# EAGLE design SolarSimulatorPanel (EAGLE 9.5.2)
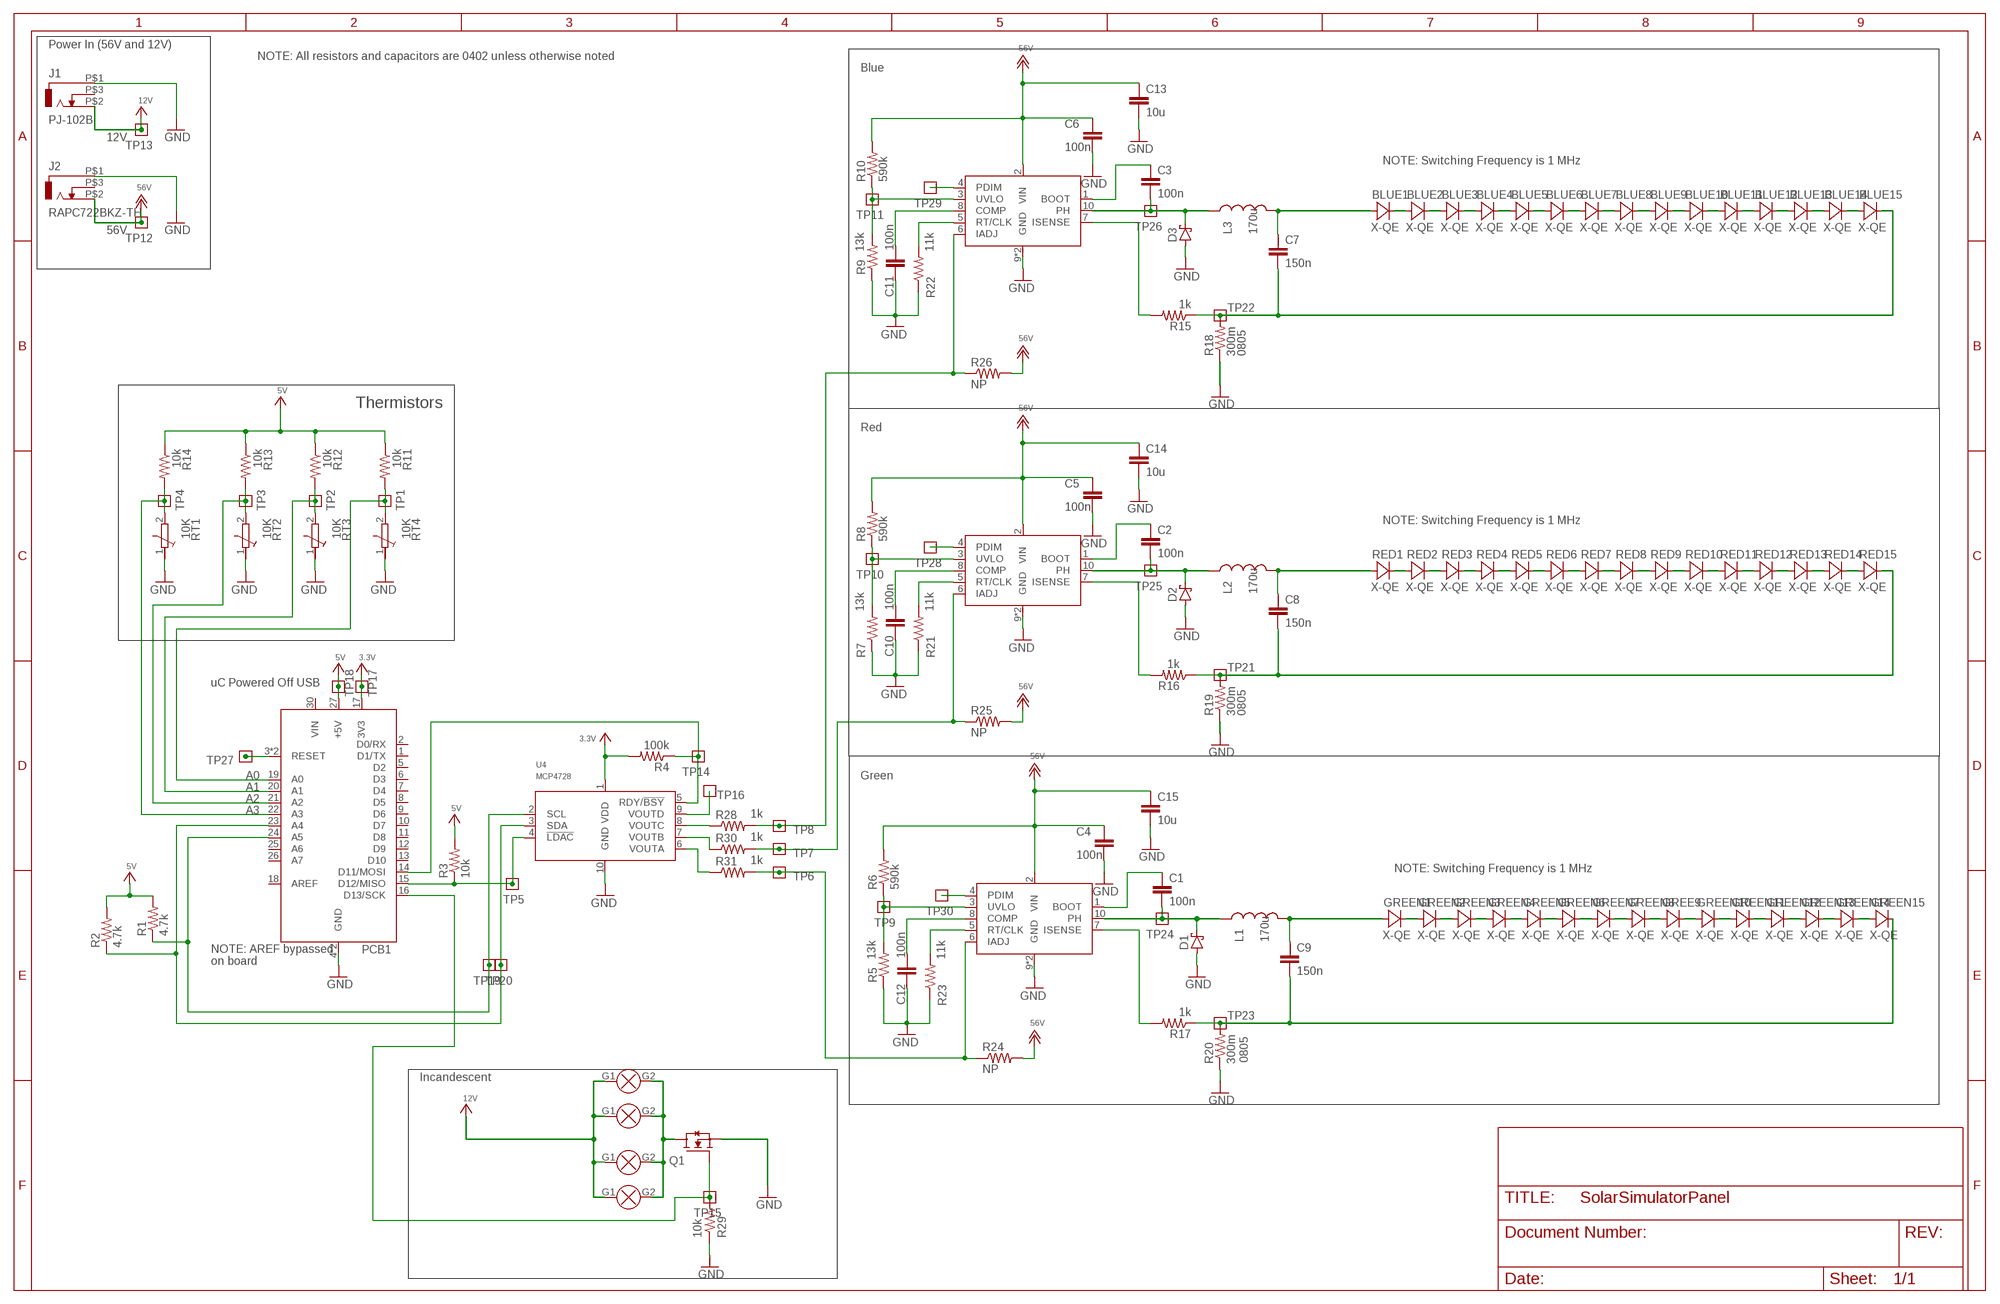
[diagram p0: schematic, sheet 1]

## Parts
BLUE1  X-QE  [X-QE]
BLUE2  X-QE  [X-QE]
BLUE3  X-QE  [X-QE]
BLUE4  X-QE  [X-QE]
BLUE5  X-QE  [X-QE]
BLUE6  X-QE  [X-QE]
BLUE7  X-QE  [X-QE]
BLUE8  X-QE  [X-QE]
BLUE9  X-QE  [X-QE]
BLUE10  X-QE  [X-QE]
BLUE11  X-QE  [X-QE]
BLUE12  X-QE  [X-QE]
BLUE13  X-QE  [X-QE]
BLUE14  X-QE  [X-QE]
BLUE15  X-QE  [X-QE]
C1  100n  C-EU0402-A-NOSILK  [.0402-A-NOSILK]
C2  100n  C-EU0402-A-NOSILK  [.0402-A-NOSILK]
C3  100n  C-EU0402-A-NOSILK  [.0402-A-NOSILK]
C4  100n  C-EU0402-A-NOSILK  [.0402-A-NOSILK]
C5  100n  C-EU0402-A-NOSILK  [.0402-A-NOSILK]
C6  100n  C-EU0402-A-NOSILK  [.0402-A-NOSILK]
C7  150n  C-EUC0805K  [C0805K]
C8  150n  C-EUC0805K  [C0805K]
C9  150n  C-EUC0805K  [C0805K]
C10  100n  C-EU0402-A-NOSILK  [.0402-A-NOSILK]
C11  100n  C-EU0402-A-NOSILK  [.0402-A-NOSILK]
C12  100n  C-EU0402-A-NOSILK  [.0402-A-NOSILK]
C13  10u  C-EUC2220K  [C2220K]
C14  10u  C-EUC2220K  [C2220K]
C15  10u  C-EUC2220K  [C2220K]
D1  D-MCC-SS2150  [DO-214AC]
D2  D-MCC-SS2150  [DO-214AC]
D3  D-MCC-SS2150  [DO-214AC]
GREE9  X-QE  [X-QE]
GREEN1  X-QE  [X-QE]
GREEN2  X-QE  [X-QE]
GREEN3  X-QE  [X-QE]
GREEN4  X-QE  [X-QE]
GREEN5  X-QE  [X-QE]
GREEN6  X-QE  [X-QE]
GREEN7  X-QE  [X-QE]
GREEN8  X-QE  [X-QE]
GREEN10  X-QE  [X-QE]
GREEN11  X-QE  [X-QE]
GREEN12  X-QE  [X-QE]
GREEN13  X-QE  [X-QE]
GREEN14  X-QE  [X-QE]
GREEN15  X-QE  [X-QE]
J1  PJ-102B  [CUI_PJ-102B]
J2  RAPC722BKZ-TH  [RAPC722BKZ]
L1  170u  7447709681  [1212NONSTANDARD]
L2  170u  7447709681  [1212NONSTANDARD]
L3  170u  7447709681  [1212NONSTANDARD]
PCB1  ARDUINO_NANO  [ARDUINO_NANO_SHIELD]
Q1  NCH-SOT223  [SOT223]
R1  4.7k  R-US_0402-A-NOSILK  [.0402-A-NOSILK]
R2  4.7k  R-US_0402-A-NOSILK  [.0402-A-NOSILK]
R3  10k  R-US_0402-A-NOSILK  [.0402-A-NOSILK]
R4  100k  R-US_0402-A-NOSILK  [.0402-A-NOSILK]
R5  13k  R-US_0402-A-NOSILK  [.0402-A-NOSILK]
R6  590k  R-US_0402-A-NOSILK  [.0402-A-NOSILK]
R7  13k  R-US_0402-A-NOSILK  [.0402-A-NOSILK]
R8  590k  R-US_0402-A-NOSILK  [.0402-A-NOSILK]
R9  13k  R-US_0402-A-NOSILK  [.0402-A-NOSILK]
R10  590k  R-US_0402-A-NOSILK  [.0402-A-NOSILK]
R11  10k  R-US_0603-B-NOSILK  [.0603-B-NOSILK]
R12  10k  R-US_0603-B-NOSILK  [.0603-B-NOSILK]
R13  10k  R-US_0603-B-NOSILK  [.0603-B-NOSILK]
R14  10k  R-US_0603-B-NOSILK  [.0603-B-NOSILK]
R15  1k  R-US_0402-A-NOSILK  [.0402-A-NOSILK]
R16  1k  R-US_0402-A-NOSILK  [.0402-A-NOSILK]
R17  1k  R-US_0402-A-NOSILK  [.0402-A-NOSILK]
R18  300m  R-US_R0805  [R0805]
R19  300m  R-US_R0805  [R0805]
R20  300m  R-US_R0805  [R0805]
R21  11k  R-US_0402-A-NOSILK  [.0402-A-NOSILK]
R22  11k  R-US_0402-A-NOSILK  [.0402-A-NOSILK]
R23  11k  R-US_0402-A-NOSILK  [.0402-A-NOSILK]
R24  NP  R-US_R0402  [R0402]
R25  NP  R-US_R0402  [R0402]
R26  NP  R-US_R0402  [R0402]
R28  1k  R-US_R0402  [R0402]
R29  10k  R-US_0402-A-NOSILK  [.0402-A-NOSILK]
R30  1k  R-US_R0402  [R0402]
R31  1k  R-US_R0402  [R0402]
RED1  X-QE  [X-QE]
RED2  X-QE  [X-QE]
RED3  X-QE  [X-QE]
RED4  X-QE  [X-QE]
RED5  X-QE  [X-QE]
RED6  X-QE  [X-QE]
RED7  X-QE  [X-QE]
RED8  X-QE  [X-QE]
RED9  X-QE  [X-QE]
RED10  X-QE  [X-QE]
RED11  X-QE  [X-QE]
RED12  X-QE  [X-QE]
RED13  X-QE  [X-QE]
RED14  X-QE  [X-QE]
RED15  X-QE  [X-QE]
RT1  10K  NTCTHERMISTER  [R0402]
RT2  10K  NTCTHERMISTER  [R0402]
RT3  10K  NTCTHERMISTER  [R0402]
RT4  10K  NTCTHERMISTER  [R0402]
TP1  TEST-POINT  [2MM-TEST-POINT]
TP2  TEST-POINT  [2MM-TEST-POINT]
TP3  TEST-POINT  [2MM-TEST-POINT]
TP4  TEST-POINT  [2MM-TEST-POINT]
TP5  TEST-POINT  [2MM-TEST-POINT]
TP6  TEST-POINT  [2MM-TEST-POINT]
TP7  TEST-POINT  [2MM-TEST-POINT]
TP8  TEST-POINT  [2MM-TEST-POINT]
TP9  TEST-POINT  [2MM-TEST-POINT]
TP10  TEST-POINT  [2MM-TEST-POINT]
TP11  TEST-POINT  [2MM-TEST-POINT]
TP12  TEST-POINT  [2MM-TEST-POINT]
TP13  TEST-POINT  [2MM-TEST-POINT]
TP14  TEST-POINT  [2MM-TEST-POINT]
TP15  TEST-POINT  [2MM-TEST-POINT]
TP16  TEST-POINT  [2MM-TEST-POINT]
TP17  TEST-POINT  [2MM-TEST-POINT]
TP18  TEST-POINT  [2MM-TEST-POINT]
TP19  TEST-POINT  [2MM-TEST-POINT]
TP20  TEST-POINT  [2MM-TEST-POINT]
TP21  TEST-POINT  [2MM-TEST-POINT]
TP22  TEST-POINT  [2MM-TEST-POINT]
TP23  TEST-POINT  [2MM-TEST-POINT]
TP24  TEST-POINT  [2MM-TEST-POINT]
TP25  TEST-POINT  [2MM-TEST-POINT]
TP26  TEST-POINT  [2MM-TEST-POINT]
TP27  TEST-POINT  [2MM-TEST-POINT]
TP28  TEST-POINT  [2MM-TEST-POINT]
TP29  TEST-POINT  [2MM-TEST-POINT]
TP30  TEST-POINT  [2MM-TEST-POINT]
U1  tps92512  TPS92512  [MSOP10]
U2  tps92512  TPS92512  [MSOP10]
U3  tps92512  TPS92512  [MSOP10]
U4  MCP4728  [MSOP10]
U$7  HL_G4BULB  [G4BASE]
U$8  HL_G4BULB  [G4BASE]
U$9  HL_G4BULB  [G4BASE]
U$10  HL_G4BULB  [G4BASE]

## Nets
3.3V: PCB1.17(3V3) R4.2 TP17.1 U4.1(VDD)
5V: PCB1.27(+5V) R1.2 R2.2 R3.2 R11.1 R12.1 R13.1 R14.1 TP18.1
12V: J1.P$2 TP13.1 U$7.G1 U$8.G1 U$9.G1 U$10.G1
56V: C4.1 C5.1 C6.1 C13.1 C14.1 C15.1 J2.P$2 R6.2 R8.2 R10.2 R24.2 R25.2 R26.2 TP12.1 U1.2(VIN) U2.2(VIN) U3.2(VIN)
88: RED5.CATHODE(C) RED6.ANODE(A)
!LDAC: PCB1.15(D12/MISO) R3.1 TP5.1 U4.4(!LDAC)
!RESET: PCB1.3(RESET) PCB1.28(RESET) TP27.1
A0: PCB1.19(A0) R11.2 RT4.2(E) TP1.1
A1: PCB1.20(A1) R12.2 RT3.2(E) TP2.1
A2: PCB1.21(A2) R13.2 RT2.2(E) TP3.1
A3: PCB1.22(A3) R14.2 RT1.2(E) TP4.1
GND: C4.2 C5.2 C6.2 C10.2 C11.2 C12.2 C13.2 C14.2 C15.2 D1.A D2.A D3.A J1.P$1 J2.P$1 PCB1.4(GND) PCB1.29(GND) Q1.3(S) R5.1 R7.1 R9.1 R18.1 R19.1 R20.1 R21.1 R22.1 R23.1 R29.1 RT1.1(A) RT2.1(A) RT3.1(A) RT4.1(A) U1.9(GND) U1.GND U2.9(GND) U2.GND U3.9(GND) U3.GND U4.10(GND)
N$1: TP16.1 U4.9(VOUTD)
N$2: GREEN10.CATHODE(C) GREEN11.ANODE(A)
N$3: R28.1 U4.8(VOUTC)
N$4: R30.1 U4.7(VOUTB)
N$5: RED6.CATHODE(C) RED7.ANODE(A)
N$6: R5.2 R6.1 TP9.1 U3.3(UVLO)
N$7: RED7.CATHODE(C) RED8.ANODE(A)
N$8: RED8.CATHODE(C) RED9.ANODE(A)
N$8SHSHOW: BLUE9.CATHODE(C) BLUE10.ANODE(A)
N$9: RED9.CATHODE(C) RED10.ANODE(A)
N$10: RED11.CATHODE(C) RED12.ANODE(A)
N$11: RED12.CATHODE(C) RED13.ANODE(A)
N$12: RED13.CATHODE(C) RED14.ANODE(A)
N$13: RED14.CATHODE(C) RED15.ANODE(A)
N$14: RED1.CATHODE(C) RED2.ANODE(A)
N$15: RED2.CATHODE(C) RED3.ANODE(A)
N$16: RED3.CATHODE(C) RED4.ANODE(A)
N$17: RED4.CATHODE(C) RED5.ANODE(A)
N$18: R25.1 R30.2 TP7.1 U2.6(IADJ)
N$19: R23.2 U3.5(RT/CLK)
N$20: BLUE6.CATHODE(C) BLUE7.ANODE(A)
N$21: BLUE7.CATHODE(C) BLUE8.ANODE(A)
N$22: C3.2 D3.C L3.P$1 TP26.1 U1.10(PH)
N$23: BLUE8.CATHODE(C) BLUE9.ANODE(A)
N$24: C2.2 D2.C L2.P$1 TP25.1 U2.10(PH)
N$25: C1.2 D1.C L1.P$1 TP24.1 U3.10(PH)
N$26: BLUE11.CATHODE(C) BLUE12.ANODE(A)
N$27: BLUE12.CATHODE(C) BLUE13.ANODE(A)
N$28: PCB1.14(D11/MOSI) R4.1 TP14.1 U4.5(RDY/!BSY)
N$29: BLUE13.CATHODE(C) BLUE14.ANODE(A)
N$30: BLUE14.CATHODE(C) BLUE15.ANODE(A)
N$31: BLUE1.CATHODE(C) BLUE2.ANODE(A)
N$32: R31.1 U4.6(VOUTA)
N$33: C12.1 U3.8(COMP)
N$34: C3.1 U1.1(BOOT)
N$35: GREEN1.CATHODE(C) GREEN2.ANODE(A)
N$36: GREEN2.CATHODE(C) GREEN3.ANODE(A)
N$37: GREEN3.CATHODE(C) GREEN4.ANODE(A)
N$38: GREEN4.CATHODE(C) GREEN5.ANODE(A)
N$39: GREEN6.CATHODE(C) GREEN7.ANODE(A)
N$40: GREEN7.CATHODE(C) GREEN8.ANODE(A)
N$41: GREE9.ANODE(A) GREEN8.CATHODE(C)
N$42: GREE9.CATHODE(C) GREEN10.ANODE(A)
N$43: GREEN11.CATHODE(C) GREEN12.ANODE(A)
N$44: GREEN12.CATHODE(C) GREEN13.ANODE(A)
N$45: GREEN13.CATHODE(C) GREEN14.ANODE(A)
N$46: GREEN14.CATHODE(C) GREEN15.ANODE(A)
N$47: C1.1 U3.1(BOOT)
N$48: BLUE2.CATHODE(C) BLUE3.ANODE(A)
N$49: BLUE3.CATHODE(C) BLUE4.ANODE(A)
N$50: BLUE4.CATHODE(C) BLUE5.ANODE(A)
N$51: C2.1 U2.1(BOOT)
N$52: R7.2 R8.1 TP10.1 U2.3(UVLO)
N$53: R9.2 R10.1 TP11.1 U1.3(UVLO)
N$54: R16.2 U2.7(ISENSE)
N$55: R17.2 U3.7(ISENSE)
N$56: BLUE5.CATHODE(C) BLUE6.ANODE(A)
N$57: BLUE10.CATHODE(C) BLUE11.ANODE(A)
N$58: R15.2 U1.7(ISENSE)
N$59: C8.2 R16.1 R19.2 RED15.CATHODE(C) TP21.1
N$61: C9.2 GREEN15.CATHODE(C) R17.1 R20.2 TP23.1
N$63: R21.2 U2.5(RT/CLK)
N$64: R26.1 R28.2 TP8.1 U1.6(IADJ)
N$65: R22.2 U1.5(RT/CLK)
N$66: C10.1 U2.8(COMP)
N$67: C11.1 U1.8(COMP)
N$68: R24.1 R31.2 TP6.1 U3.6(IADJ)
N$69: C9.1 GREEN1.ANODE(A) L1.P$2
N$70: C8.1 L2.P$2 RED1.ANODE(A)
N$71: BLUE15.CATHODE(C) C7.2 R15.1 R18.2 TP22.1
N$72: BLUE1.ANODE(A) C7.1 L3.P$2
N$73: Q1.2(D) Q1.4(D) U$7.G2 U$8.G2 U$9.G2 U$10.G2
N$77: GREEN5.CATHODE(C) GREEN6.ANODE(A)
N$79: PCB1.16(D13/SCK) Q1.1(G) R29.2 TP15.1
N$84: TP30.1 U3.4(PDIM)
N$85: TP28.1 U2.4(PDIM)
N$86: TP29.1 U1.4(PDIM)
N$88: RED10.CATHODE(C) RED11.ANODE(A)
SCL: PCB1.24(A5) R1.1 TP19.1 U4.2(SCL)
SDA: PCB1.23(A4) R2.1 TP20.1 U4.3(SDA)
Unconnected: J1.P$3 J2.P$3 PCB1.1(D1/TX) PCB1.2(D0/RX) PCB1.5(D2) PCB1.6(D3) PCB1.7(D4) PCB1.8(D5) PCB1.9(D6) PCB1.10(D7) PCB1.11(D8) PCB1.12(D9) PCB1.13(D10) PCB1.25(A6) PCB1.26(A7)

## Notes on the sheet
- Power In (56V and 12V)
- NOTE: All resistors and capacitors are 0402 unless otherwise noted
- Blue
- NOTE: Switching Frequency is 1 MHz
- 0805
- Thermistors
- Red
- NOTE: Switching Frequency is 1 MHz
- uC Powered Off USB
- 0805
- Green
- NOTE: Switching Frequency is 1 MHz
- NOTE: AREF bypassed 
  on board
- 0805
- Incandescent

## Power pins joined to a net without a drawn wire
AREF: PCB1.18(AREF)
VIN: PCB1.30(VIN)

## Library data of the parts
BLUE1-BLUE8 BLUE10-BLUE15 = D-Cree-XQE-LED:X-QE; DIS: Digi-Key; DPN: XQEROY-00-0000-000000L01CT-ND; GENERIC: N; MFR: Cree; MPN: XQEROY-00-0000-000000L01
BLUE9 = D-Cree-XQE-LED:X-QE; DIS: Digi-Key; DPM: XQEROY-00-0000-000000L01CT-ND; DPN: XQEROY-00-0000-000000L01CT-ND; GENERIC: N; MFR: Cree; MPN: XQEROY-00-0000-000000L01
C1 C2 C4-C6 C10-C12 = oresat-rcl:C-EU: CAPACITOR, European symbol; DIS: Digi-Key; DPN: 490-10458-1-ND; GENERIC: N; MFR: Murata; MPN: GRM155R62A104KE14D
C3 = oresat-rcl:C-EU: CAPACITOR, European symbol
C7-C9 = rcl:C-EU: CAPACITOR, European symbol; DIS: Digi-Key; DPN: 490-16332-2-ND; GENERIC: Y; MFR: Murata; MPN: GRM188R71H154KAC4D; SPICEPREFIX: C
C13-C15 = rcl:C-EU: CAPACITOR, European symbol; DIS: Digi-Key; DPN: 478-9622-1-ND; GENERIC: Y; MFR: AVX; MPN: 22201C106MAT2A; SPICEPREFIX: C
D1-D3 = D-MCC-SS2150-Schottky:D-MCC-SS2150; DIS: Digi-Key; DPN: SS2150-LTPMSCT-ND; GENERIC: N; MFR: Micro; MPN: SS2150-LTP
GREE9 GREEN1-GREEN8 GREEN10-GREEN15 = D-Cree-XQE-LED:X-QE; DIS: Digi-Key; DPN: XQEGRN-00-0000-000000D03CT-ND; GENERIC: N; MFR: Cree; MPN: XQEGRN-00-0000-000000D03
J1 = J-CUI-PJ102B-Barrel_Jack:PJ-102B: 2.5 mm Center Pin, 2.5 A, Right Angle, Through Hole, Tapered Pins, Dc Power Jack Connector; AVAILABILITY: Unavailable; CUI_PURCHASE_URL: https://www.cuidevices.com/product/interconnect/connectors/dc-power-connectors/jacks/pj-102b?utm_source=snapeda.com&utm_medium=referral&utm_campaign=snapedaBOM; DESCRIPTION: 2.5 x 6.5 mm, 2.5 A, Horizontal, Through Hole, Tapered Pins, Dc Power Jack Connector; DIS: Digi-Key; DPN: 626-1968-ND; GENERIC: N; MF: CUI Devices; MFR: Conec; MP: PJ-102B; PACKAGE: None; PRICE: None
J2 = J-SwitchCraft-RAPC722BKZ-Barrel_Jack:RAPC722BKZ-TH; DIS: Digi-Key; DPN: SC3832-ND; GENERIC: N; MFR: SwitchCraft; MPN: RAPC722BKZ
L1-L3 = L_Wurst_7447709681:7447709681; DIS: Digi-Key; DPN: TE2201TR-ND; GENERIC: N; MFR: Amgis; MPN: SH150S-1.02-168
PCB1 = U-Arduino-Nano-DevBoard:ARDUINO_NANO: Arduino Nano, Through Hole and SMT.
Q1 = Q-MOSFET-NCH-SOT223:NCH-SOT223; DIS: Digi-Key; DPN: DMN6068SE-13CT-ND; GENERIC: N; MFR: Diodes; MPN: DMN6068SE
R1 = oresat-rcl:R-US_: RESISTOR, American symbol; DIS: Digi-Key; DPN: 311-4.7KJRCT-ND; GENERIC: Y; MFR: Yageo; MPN: RC0402JR-074K7L
R2 = oresat-rcl:R-US_: RESISTOR, American symbol; DIS: Digi-Key; DPN: 311-4.7KJRCT-ND; GENERIC: Y; MFR: Yageo; MPN: 311-4.7KJRCT-ND
R3 R11 R12 R14 R29 = oresat-rcl:R-US_: RESISTOR, American symbol; DIS: Digi-Key; DPN: 311-10.0KLRCT-ND; GENERIC: Y; MPN: RC0402FR-0710KL
R4 = oresat-rcl:R-US_: RESISTOR, American symbol
R5 R7 R9 = oresat-rcl:R-US_: RESISTOR, American symbol; DIS: Digi-Key; DPN: P13KDCCT-ND; GENERIC: Y; MFR: Panasonic; MPN: ERA-2AEB133X
R6 R8 R10 = oresat-rcl:R-US_: RESISTOR, American symbol; DIS: Digi-Key; DPN: RMCF0402FT590KCT-ND; GENERIC: Y; MFR: Stackpole; MPN: RMCF0402FT590K
R13 = oresat-rcl:R-US_: RESISTOR, American symbol; DIS: Digi-Key; GENERIC: Y; MPN: RC0402FR-0710KL
R15-R17 = oresat-rcl:R-US_: RESISTOR, American symbol; DIS: Digi-Key; DPN: 311-1.00KLRCT-ND; GENERIC: Y; MFR: Yageo; MPN: RC0402FR-071KL
R18-R20 = rcl:R-US_: RESISTOR, American symbol; DIS: Digi-Key; DPN: P19247CT-ND; GENERIC: Y; MFR: Panasonic; MPN: ERJ-6DQJR30V; SPICEPREFIX: R
R21-R23 = oresat-rcl:R-US_: RESISTOR, American symbol; DIS: Digi-Key; DPN: P11KDBCT-ND; GENERIC: Y; MFR: Panasonic; MPN: ERA-3AEB113V
R24-R26 = rcl:R-US_: RESISTOR, American symbol; SPICEPREFIX: R
R28 R30 R31 = rcl:R-US_: RESISTOR, American symbol; DIS: Digi-Key; DPN: 311-1.00KLRCT-ND; GENERIC: Y; MFR: Yageo; MPN: RC0402FR-071KL; SPICEPREFIX: R
RED1-RED15 = D-Cree-XQE-LED:X-QE; DIS: Digi-Key; DPN: XQERED-00-0000-000000701CT-ND; GENERIC: N; MFR: Cree; MPN: XQERED-00-0000-000000701
RT1 RT3 = R-Generic-Thermister0402:NTCTHERMISTER; DISTRIBUTOR: Digi-Key; DPN: 445-2550-1-ND; GENERIC: N; MFR: TDK; MPN: NTCG103JF103FT1
RT2 = R-Generic-Thermister0402:NTCTHERMISTER; DISTRIBUTOR: Digi-key; DPN: 445-2550-1-ND; GENERIC: N; MFR: TDK; MPN: NTCG103JF103FT1
RT4 = R-Generic-Thermister0402:NTCTHERMISTER; DISTRIBUTOR: digikey; DPN: 445-2550-1-ND; GENERIC: N; MFR: TDK; MPN: NTCG103JF103FT1
TP1-TP30 = Tova:TEST-POINT
U1 = U-TI-TPS92512-buck:TPS92512; DIS: Digi-Key; DPN: 296-41002-1-ND; GENERIC: N; MFR: Texas Instruments; MPN: TPS92512DGQR
U2 = U-TI-TPS92512-buck:TPS92512; DIS: Digi-key; DPN: 296-41002-1-ND; GENERIC: N; MFR: Texas Instruments; MPN: TPS92512DGQR
U3 = U-TI-TPS92512-buck:TPS92512; DIS: Digi-Key; DPN: 296-41002-1-ND; MFR: Texas Instruments; MPN: TPS92512DGQR
U4 = U-Microchip-MCP4728-QuadDAC:MCP4728; DIS: Digi-Key; DPN: MCP4728T-E/UNCT-ND; GENERIC: N; MFR: Microchip; MPN: MCP4728T-E/UN
U$7 U$9 U$10 = HL_HalogenBulb_G4Base:HL_G4BULB; DIS: 1000Bulbs; DPN: Q-G412V102130; GENERIC: N; MFR: Plusrite; MPN: 3301
U$8 = HL_HalogenBulb_G4Base:HL_G4BULB; DIS: 1000Bulbs; DPN: Q-G412V102130; GENERIC: N; MPN: 3301

## Board
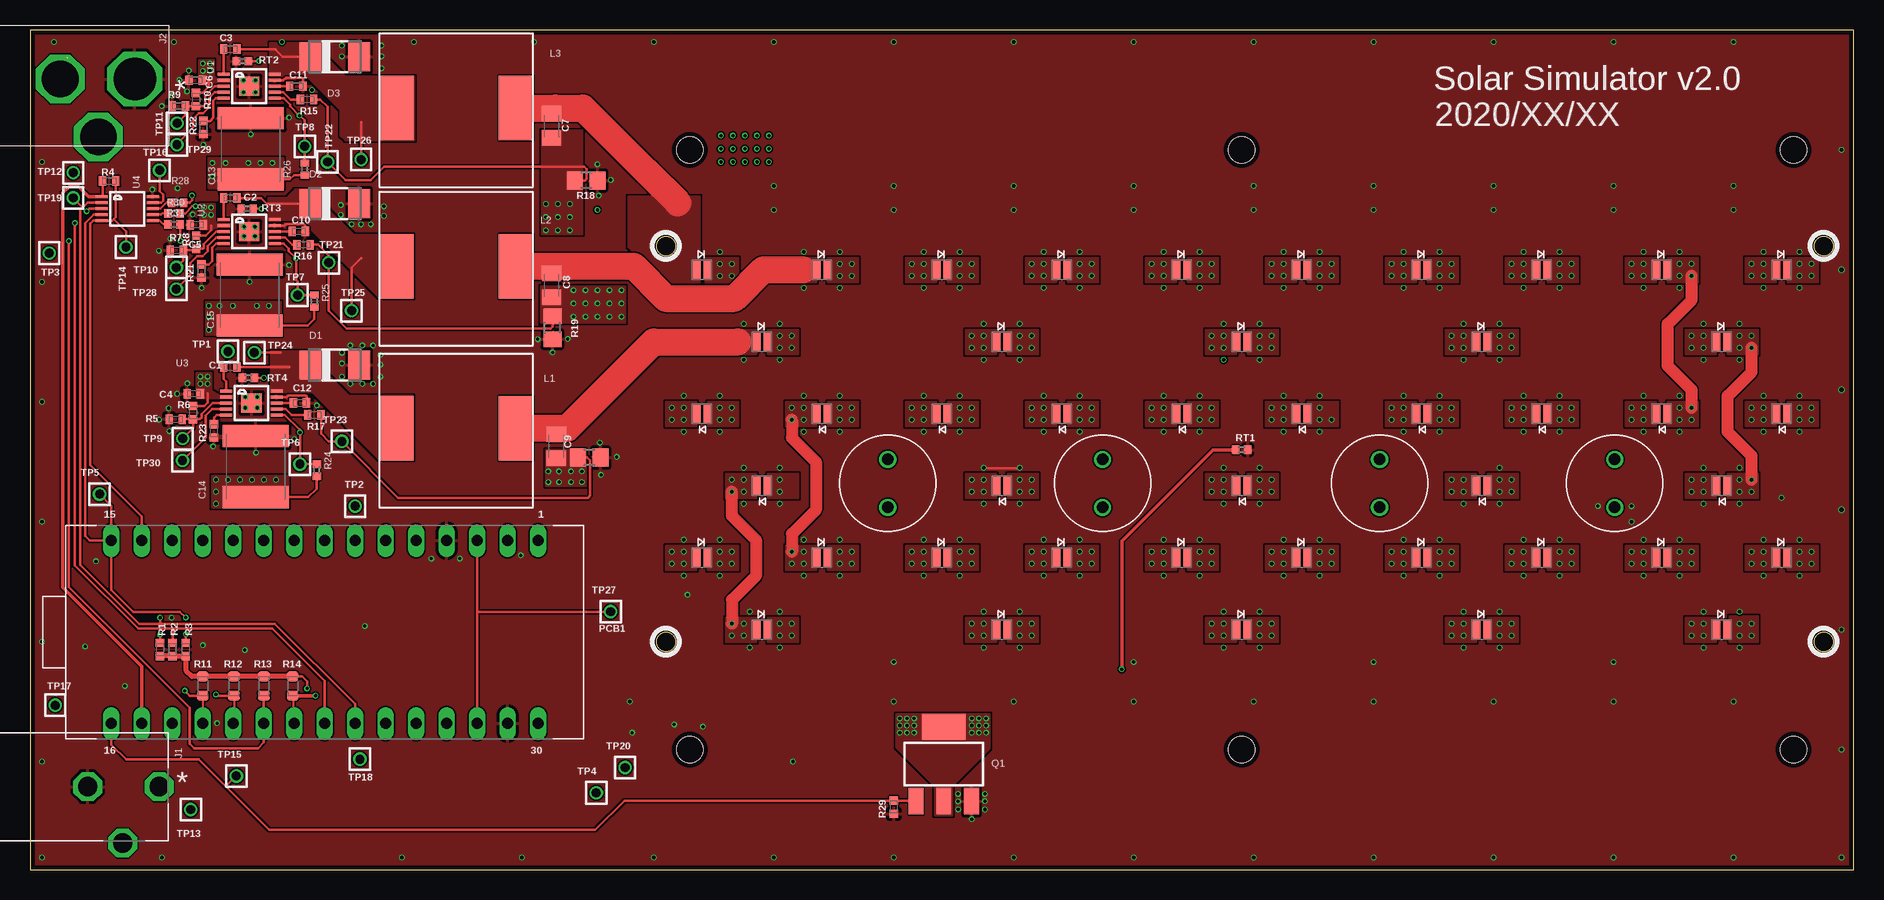
[diagram p1: board, top side]
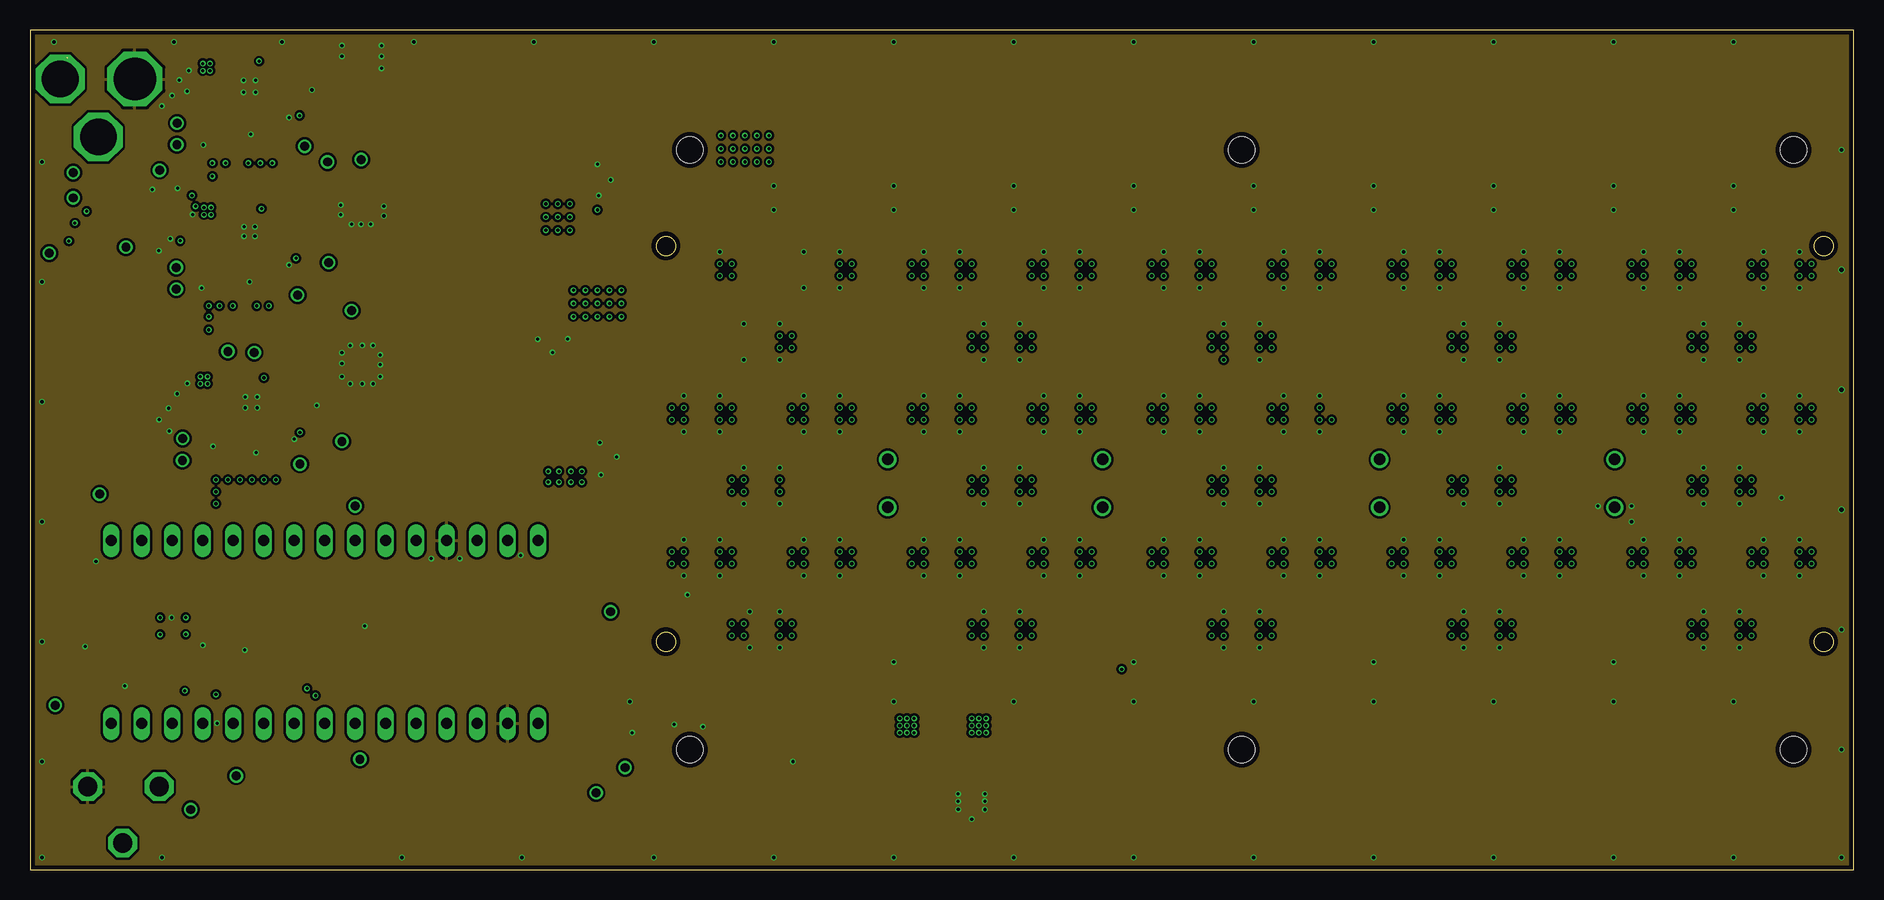
[diagram p2: board, inner layer Route2]
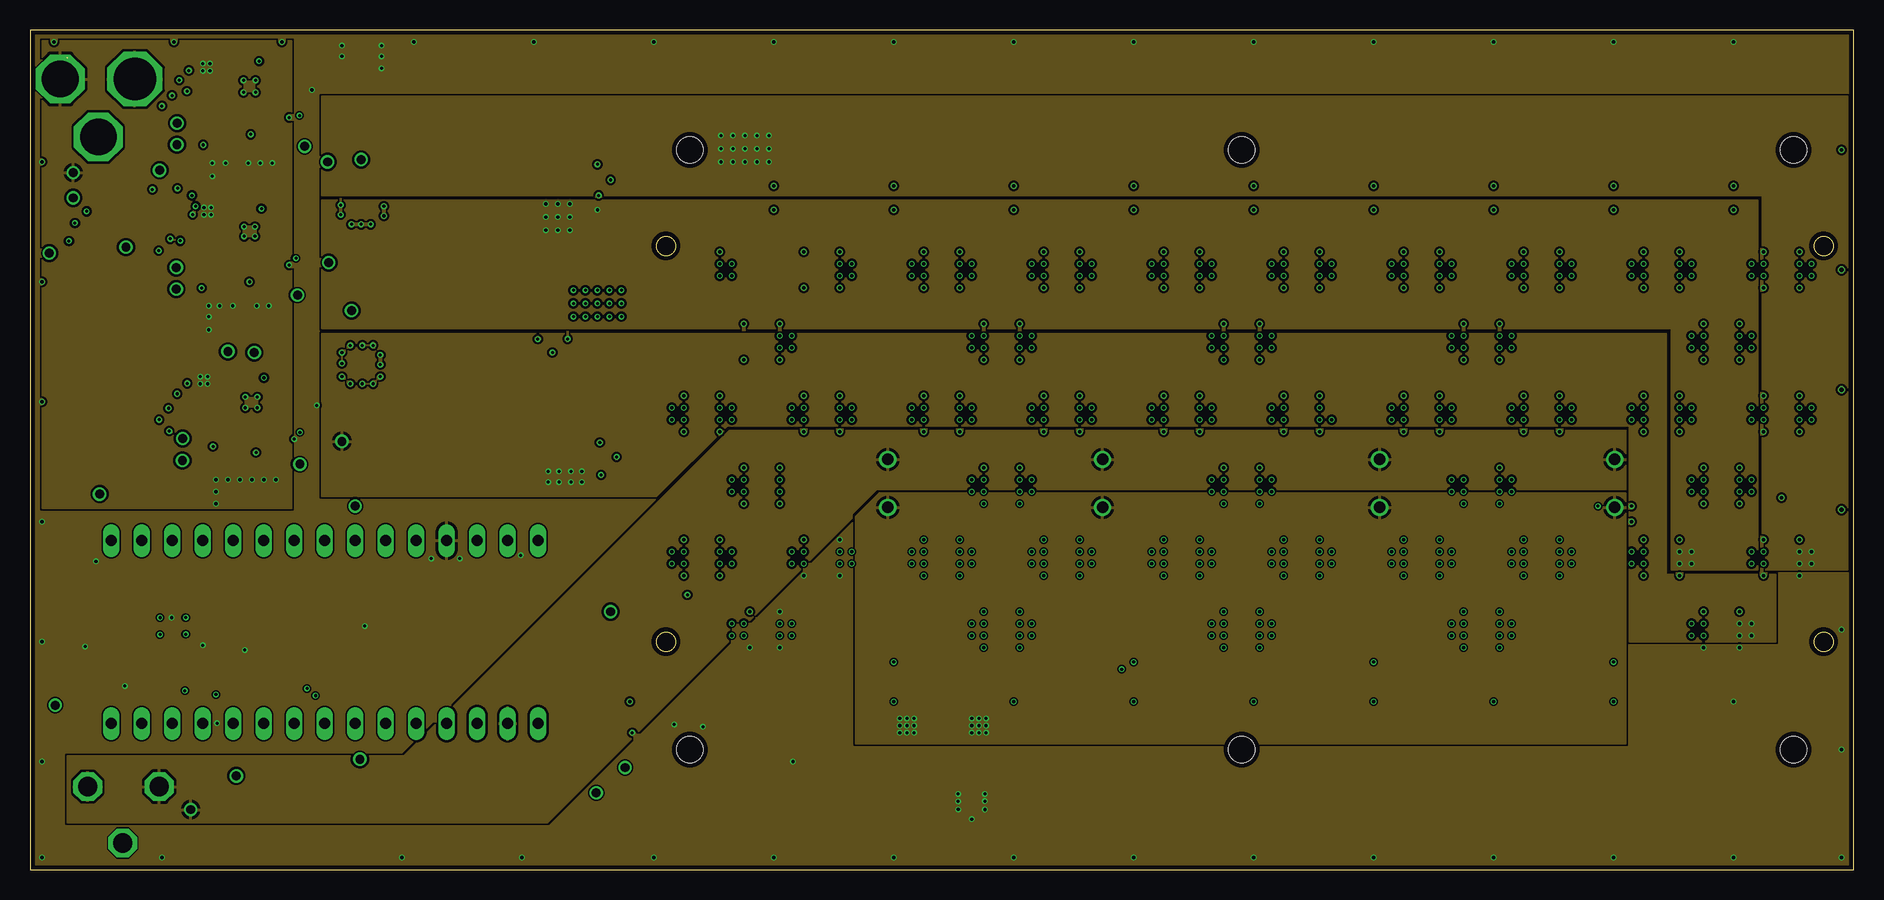
[diagram p3: board, inner layer Route15]
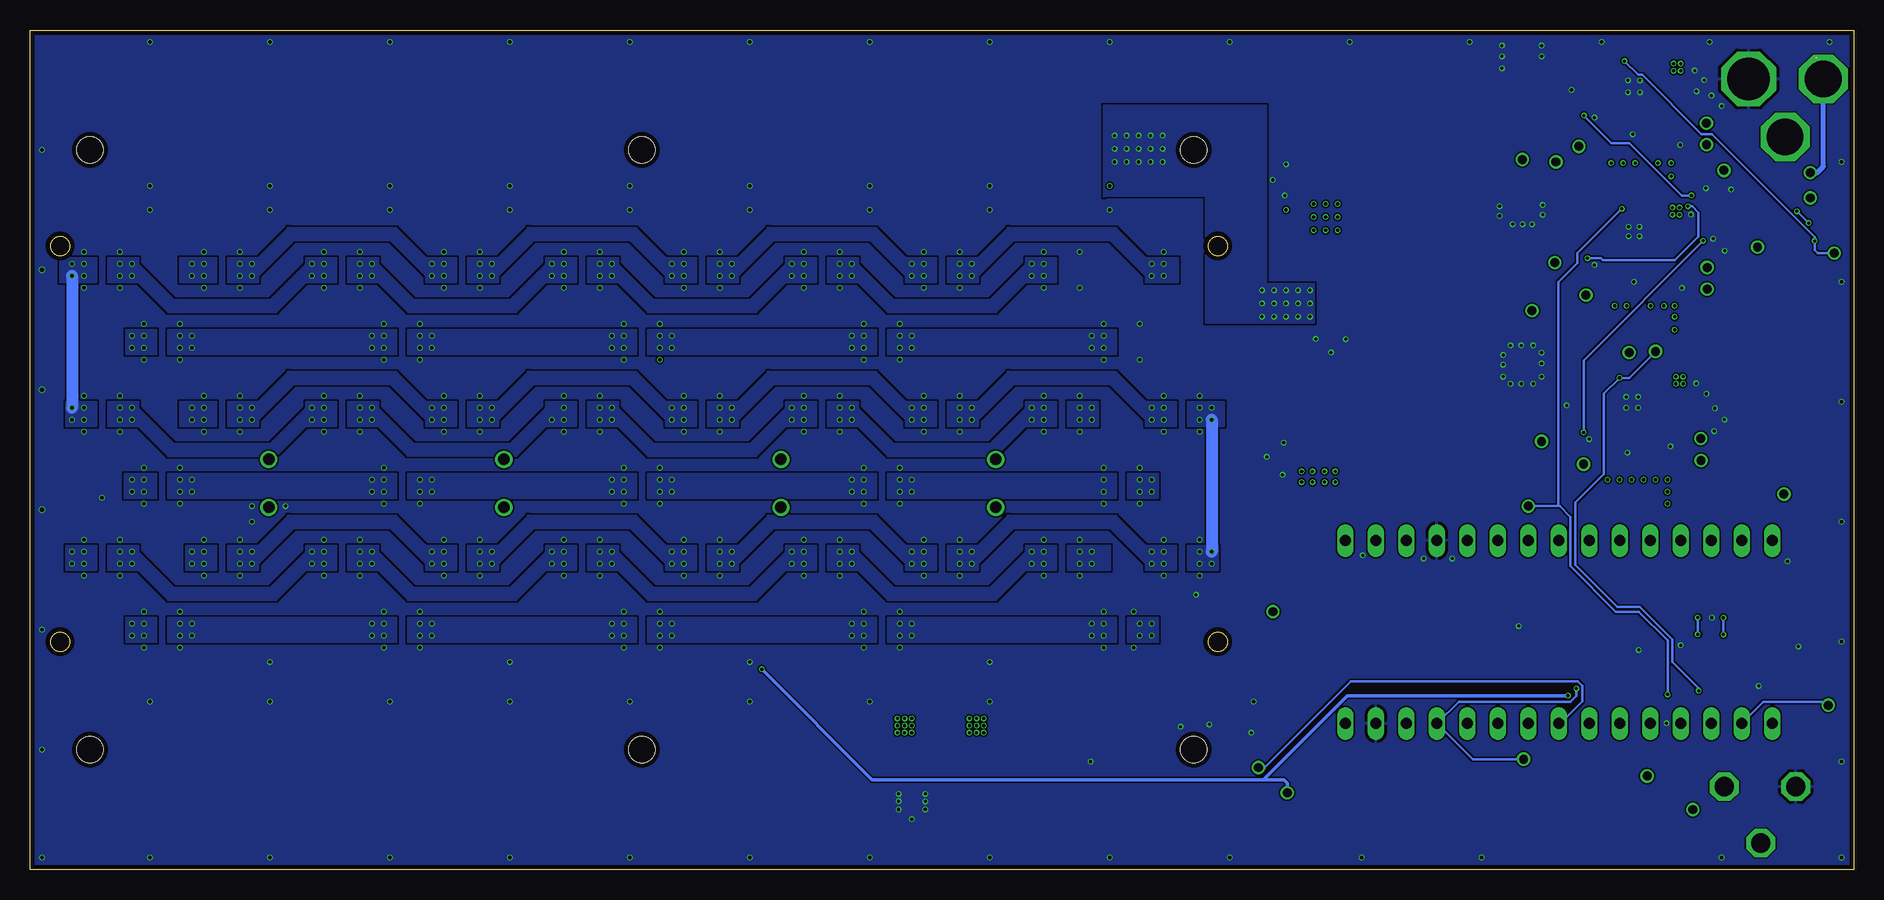
[diagram p4: board, bottom side, seen from below]

Size 152 x 70 mm. Coordinates in mm from the lower left corner, seen from the top.
Outline: 0,0 152,0 152,70 0,70 0,0
Outline: circle at 149.5,19 radius 0.8
Outline: circle at 53,52 radius 0.8
Outline: circle at 53,19 radius 0.8
Outline: circle at 149.5,52 radius 0.8
Copper layers (1*2*15*16): Top 0.035559375mm / dielectric 0.17018125mm / Route2 0.01778125mm / dielectric 47mil / Route15 0.01778125mm / dielectric 0.17018125mm / Bottom 0.035559375mm
Design rules "oshpark-4layer *": minimum track width 5mil, minimum drill 10mil, track to track 5mil, track to pad 5mil, pad to pad 5mil, via to via 5mil, smd to smd 5mil, copper to edge 15mil, drill to drill 6mil, minimum pad ring 4mil, minimum via ring 4mil, stop-mask expansion 2.5mil, vias tented up to drill 10mil, thermal gap 10mil
Holes 2.2 mm at 147,60 147,10 55,10 55,60 101,60 101,10

### Footprints (pad centres in the part's own frame; a part is rotated, then mirrored left to right if it is on the bottom)
X-QE = smd 0.65 x 1.6: ANODE -0.45,0; CATHODE 0.45,0
.0402-A-NOSILK = smd 0.7 x 0.8: 1 -0.55,0; 2 0.55,0
C0805K = smd 1.3 x 1.6: 1 -1,0; 2 1,0
C2220K = smd 1.85 x 5.5: 1 -2.55,0; 2 2.55,0
DO-214AC = smd 1.8 x 2.4: A 2.025,0; C -2.025,0
CUI_PJ-102B = drill 1.6 octagon: P$1 -0.508,0; P$2 -6.477,0; P$3 -3.429,4.699
RAPC722BKZ = drill 3.556 octagon: P$1 0,3.048 | drill 3.048 octagon: P$2 0,-3.175; P$3 4.826,0
1212NONSTANDARD = smd 2.9 x 5.4: P$1 -5.08,0; P$2 4.92,0
ARDUINO_NANO_SHIELD = drill 0.914 long: 1 19.05,7.62; 2 16.51,7.62; 3 13.97,7.62; 4 11.43,7.62; 5 8.89,7.62; 6 6.35,7.62; 7 3.81,7.62; 8 1.27,7.62; 9 -1.27,7.62; 10 -3.81,7.62; 11 -6.35,7.62; 12 -8.89,7.62; 13 -11.43,7.62; 14 -13.97,7.62; 15 -16.51,7.62; 16 -16.51,-7.62; 17 -13.97,-7.62; 18 -11.43,-7.62; 19 -8.89,-7.62; 20 -6.35,-7.62; 21 -3.81,-7.62; 22 -1.27,-7.62; 23 1.27,-7.62; 24 3.81,-7.62; 25 6.35,-7.62; 26 8.89,-7.62; 27 11.43,-7.62; 28 13.97,-7.62; 29 16.51,-7.62; 30 19.05,-7.62
SOT223 = smd 1.219 x 2.235: 1 -2.311,-3.099; 2 0,-3.099; 3 2.311,-3.099 | smd 3.6 x 2.2: 4 0,3.099
.0603-B-NOSILK = smd 0.8 x 0.95: 1 -0.8,0; 2 0.8,0
R0805 = smd 1.3 x 1.5: 1 -0.95,0; 2 0.95,0
R0402 = smd 0.6 x 0.7: 1 -0.5,0; 2 0.5,0
2MM-TEST-POINT = drill 0.737: 1 0,0
MSOP10 = smd 0.25 x 1: 1 -1,-2.113; 2 -0.5,-2.113; 3 0,-2.113; 4 0.5,-2.113; 5 1,-2.113; 6 1,2.113; 7 0.5,2.113; 8 0,2.113; 9 -0.5,2.113; 10 -1,2.113 | smd 1.6 x 1.7: GND 0,0
MSOP10' = smd 0.25 x 1: 1 -1,-2.113; 2 -0.5,-2.113; 3 0,-2.113; 4 0.5,-2.113; 5 1,-2.113; 6 1,2.113; 7 0.5,2.113; 8 0,2.113; 9 -0.5,2.113; 10 -1,2.113
G4BASE = drill 0.95: G1 -2,0; G2 2,0

### Placement (x,y rotation side)
BLUE1  56,50 0 top
BLUE2  76,50 0 top
BLUE3  96,50 0 top
BLUE4  116,50 0 top
BLUE5  136,50 0 top
BLUE6  136,38 180 top
BLUE7  116,38 180 top
BLUE8  96,38 180 top
BLUE9  76,38 180 top
BLUE10  56,38 180 top
BLUE11  56,26 0 top
BLUE12  76,26 0 top
BLUE13  96,26 0 top
BLUE14  116,26 0 top
BLUE15  136,26 0 top
C1  16.7,41.9 0 top
C2  16.7,56 0 top
C3  16.7,68.4 0 top
C4  13.65,39.66 180 top
C5  13.9,53.76 180 top
C6  13.79,65.81 180 top
C7  43.48,61.98 270 top
C8  43.48,48.7 270 top
C9  43.88,35.3 270 top
C10  22.4,53.2 0 top
C11  22.2,65.31 0 top
C12  22.5,38.9 0 top
C13  18.4,60.1 90 top
C14  18.8,33.6 90 top
C15  18.3,47.9 90 top
D1  25.41,42.08 0 top
D2  25.41,55.53 0 top
D3  25.41,67.78 0 top
GREE9  81,32 180 top
GREEN1  61,44 0 top
GREEN2  81,44 0 top
GREEN3  101,44 0 top
GREEN4  121,44 0 top
GREEN5  141,44 0 top
GREEN6  141,32 180 top
GREEN7  121,32 180 top
GREEN8  101,32 180 top
GREEN10  61,32 180 top
GREEN11  61,20 0 top
GREEN12  81,20 0 top
GREEN13  101,20 0 top
GREEN14  121,20 0 top
GREEN15  141,20 0 top
J1  4.3,6.91 180 top
J2  5.7,65.92 270 top
L1  35.6,36.8 0 top
L2  35.6,50.3 0 top
L3  35.6,63.5 0 top
PCB1  23.3,19.8 0 top
Q1  76.17,8.8 0 top
R1  10.85,18.34 270 top
R2  11.88,18.35 270 top
R3  12.98,18.35 270 top
R4  6.6,57.4 180 top
R5  12.14,37.55 0 top
R6  13.6,38.1 90 top
R7  12.23,51.64 0 top
R8  13.86,52.3 90 top
R9  12.4,63.66 0 top
R10  13.85,64.2 90 top
R11  14.4,15.3 270 top
R12  17,15.3 270 top
R13  19.5,15.3 270 top
R14  21.9,15.3 270 top
R15  23.1,64.2 180 top
R16  22.8,52.1 180 top
R17  23.7,37.9 180 top
R18  46.37,57.45 180 top
R19  43.55,45.17 90 top
R20  46.62,34.35 180 top
R21  14.3,49.9 90 top
R22  14.45,61.87 90 top
R23  15.34,36.57 90 top
R24  23.9,33.3 270 top
R25  23.7,47.4 270 top
R26  22.9,58.4 270 top
R28  12.3,55.6 0 top
R29  72,5.2 90 top
R30  12,54.7 0 top
R31  12,53.8 0 top
RED1  66,50 0 top
RED2  86,50 0 top
RED3  106,50 0 top
RED4  126,50 0 top
RED5  146,50 0 top
RED6  146,38 180 top
RED7  126,38 180 top
RED8  106,38 180 top
RED9  86,38 180 top
RED10  66,38 180 top
RED11  66,26 0 top
RED12  86,26 0 top
RED13  106,26 0 top
RED14  126,26 0 top
RED15  146,26 0 top
RT1  101,35 180 top
RT2  17.7,67.4 0 top
RT3  18.1,55.1 0 top
RT4  18.2,41 0 top
TP1  16.5,43.2 0 top
TP2  27.1,30.3 0 top
TP3  1.6,51.4 0 top
TP4  47.2,6.4 0 top
TP5  5.8,31.3 0 top
TP6  22.5,33.8 0 top
TP7  22.3,47.9 0 top
TP8  22.9,60.3 0 top
TP9  12.72,35.93 0 top
TP10  12.2,50.2 0 top
TP11  12.26,62.23 0 top
TP12  3.6,58.1 0 top
TP13  13.4,5 0 top
TP14  8,51.9 0 top
TP15  17.2,7.8 0 top
TP16  10.8,58.3 0 top
TP17  2.1,13.7 0 top
TP18  27.5,9.2 0 top
TP19  3.6,56 0 top
TP20  49.6,8.5 0 top
TP21  24.9,50.6 0 top
TP22  24.8,59 0 top
TP23  26,35.7 0 top
TP24  18.7,43.1 0 top
TP25  26.8,46.6 0 top
TP26  27.6,59.2 0 top
TP27  48.4,21.5 0 top
TP28  12.2,48.4 0 top
TP29  12.25,60.44 0 top
TP30  12.71,34.1 0 top
U1  18.27,65.31 270 top
U2  18.27,53.2 270 top
U3  18.47,38.9 270 top
U4  MCP4728  [MSOP10']  8.1,55.1 270 top
U$7  71.5,32.2 270 top
U$8  89.4,32.2 270 top
U$9  112.5,32.2 270 top
U$10  132.1,32.2 270 top

### Tracks (layer width: path | path; a pad name or v marks a point on that pad's centre or on a via)
3.3V
  Top 0.2: R4.2 6.05,56.16 U4.1
  Top 0.3: U4.1 4.9,56.1 4,57 3.3,57 2.73,56.44 2.73,23.53 9.33,16.94 PCB1.17
  Bottom 0.2: TP17.1 2.4,14 7.51,14 PCB1.17
5V  (via drill 0.25)
  Top 0.2: v23.1,15.1 23.1,15.7 22.7,16.1 R14.1
  Top 0.4: R14.1 R13.1 R12.1 R11.1 13.5,16.1 12.98,16.62 R3.2 R2.2 R1.2
  Bottom 0.2: v23.1,15.1 23.1,14.49 23.59,14 32.91,14 PCB1.27 31.75,9.2 TP18.1
12V
  pour Route15 (isolate 0.2, rank 2): 3.1,9.5 31.2,9.5 58.3,36.6 133.1,36.6 133.1,31.5 70.7,31.5 43.1,3.9 3.1,3.9
56V  (via drill 0.25)
  Top 0.2: R8.2 14.65,52.85 15.1,53.3 15.1,53.7 | R26.2 22,57.9 21.65,57.55 C13.1 | R10.2 14.39,64.75 14.9,65.26 14.9,65.8 | R6.2 14.5,38.65 14.8,38.95 14.8,39.7 | C15.1 23.15,45.35 23.7,45.9 R25.2 | R24.2 23.9,31.75 23.2,31.05 C14.1
  Bottom 0.4: J2.P$2 2.52,58.62 3.04,58.1 TP12.1
  other vias: 14.4,66.6 15,66.6 14.4,67.2 15,67.2 14.5,54.6 15.1,54.6 14.5,55.2 15.1,55.2 14.2,40.5 14.8,40.5 14.2,41.1 14.8,41.1 15.5,30.5 15.5,31.5 15.5,32.5 17.5,32.5 18.5,32.5 19.5,32.5 20.5,32.5 14.9,45 14.9,46.1 14.9,47 15.8,47 16.9,47 18.9,47 19.9,47 15.2,57.8 15.2,58.9 16.3,58.9 18.2,58.9 19.2,58.9 20.2,58.9 16.5,32.5
  pour Top (no thermals): 16.7,65.7 15.6,65.7 15.4,65.5 14.1,65.5 14.1,67.5 15.3,67.5 15.3,66.2 15.6,65.9 16.7,65.9
  pour Top (no thermals): 16.7,53.8 15.7,53.8 15.4,54.1 15.4,55.5 14.2,55.5 14.2,53.4 15.5,53.4 15.7,53.6 16.7,53.6
  pour Top (no thermals): 17,39.3 13.9,39.3 13.9,41.4 15.1,41.4 15.1,39.89 15.8,39.5 17,39.5
  pour Route15 (isolate 0.2): 1,69.1 1,30.1 21.8,30.1 21.8,69.1
  pour Top (no thermals): 14.9,56.8 21.1,56.8 21.1,59.3 14.9,59.3
  pour Top (no thermals): 14.7,44.6 20.9,44.6 20.9,47.3 14.7,47.3
  pour Top (no thermals): 15.2,30.2 21.5,30.2 21.5,32.8 15.2,32.8
88  (via drill 0.25)
  Bottom 1: v148.5,49.5 v148.5,38.5
  other vias: 147.5,50.5 147.5,49.5 147.5,37.5 147.5,38.5 148.5,37.5 148.5,50.5
  pour Top (no thermals): 146.5,39 149,39 149,37 146.5,37
  pour Bottom (no thermals): 146.5,39 149,39 149,37 146.5,37
  pour Bottom (no thermals): 146.5,51 149.5,51 149.5,49 146.5,49
  pour Top (no thermals): 146.5,51 149,51 149,49 146.5,49
!LDAC  (via drill 0.25)
  Top 0.2: v12.98,19.61 R3.1 | U4.4 5.3,54.6 4.6,53.9 4.6,27.8 4.98,27.42 PCB1.15 | v12.98,21 12.48,21.5 8.6,21.5 6.79,23.31 PCB1.15 | TP5.1 6.79,30.31 PCB1.15
  Bottom 0.2: v12.98,21 v12.98,19.61
!RESET
  Top 0.2: PCB1.28 37.27,21.5 | 37.27,21.5 PCB1.3 | TP27.1 37.27,21.5
A0  (via drill 0.25)
  Top 0.152: R11.2 PCB1.19
  Top 0.2: RT4.2 v19.5,41 | R11.2 13.3,14.5 v12.9,14.9
  Bottom 0.2: v12.9,14.9 12.9,15.1 15.1,17.3 15.1,19.2 17.8,21.9 19.7,21.9 23.2,25.4 23.2,30.6 20.8,33 20.8,39.7 v19.5,41 RT4.2 TP1.1
A1  (via drill 0.25)
  Top 0.152: R12.2 17,12.23 PCB1.20
  Top 0.2: v15.5,14.6 15.6,14.5 R12.2 | RT3.2 v19.3,55.1
  Bottom 0.2: v15.5,14.6 15.5,19.1 17.9,21.5 19.8,21.5 23.6,25.3 23.6,29.4 24.5,30.3 | v19.3,55.1 23.02,51.38 23.02,50.58 24.6,49 24.6,30.4 24.5,30.3 | TP2.1 24.5,30.3
A2  (via drill 0.25)
  Top 0.152: R13.2
  Top 0.2: R13.2 PCB1.21 19.49,10.59 19,10.1 13.7,10.1 13.3,10.5 13.3,13.5 3.24,23.56 v3.24,52.4 | RT2.2 v19.1,67.4
  Bottom 0.2: v19.1,67.4 17.96,66.26 17.61,66.26 12.67,61.31 11.83,61.31 3.24,52.73 v3.24,52.4 3.24,51.64 3,51.4 TP3.1
A3  (via drill 0.25)
  Top 0.152: 21.93,14.47 21.93,12.28 PCB1.22
  Top 0.3: RT1.2 98.6,35 91,27.4 v91,16.7 | 21.93,14.47 R14.2 v23.8,14.5
  Bottom 0.3: v91,16.7 81.8,7.5 49.2,7.5 | 49.2,7.5 47.5,7.5 47.2,7.2 TP4.1 | v23.8,14.5 42.2,14.5 49.2,7.5
GND  (via drill 0.25, 0.35)
  Top 0.152: v79.5,33.5 v82.5,33.5 | 18.97,65.31 U1.GND
  Top 0.2: U2.9 21.21,53.7 21.34,53.83 22.82,53.83 22.95,53.7 C10.2 | U1.9 21.11,65.81 21.34,66.04 22.63,66.04 22.75,65.91 C11.2 | C12.2 23.05,39.45 22.97,39.53 21.54,39.53 21.41,39.4 U3.9
  other vias: 57.5,51.5 77.5,48.5 74.5,48.5 74.5,51.5 77.5,51.5 97.5,48.5 94.5,48.5 94.5,51.5 97.5,51.5 117.5,48.5 114.5,48.5 114.5,51.5 117.5,51.5 137.5,48.5 134.5,48.5 134.5,51.5 137.5,51.5 137.5,36.5 134.5,36.5 134.5,39.5 137.5,39.5 117.5,36.5 114.5,36.5 114.5,39.5 117.5,39.5 122.5,42.5 119.5,42.5 119.5,45.5 122.5,45.5 102.5,42.5 99.5,45.5 102.5,45.5 82.5,42.5 79.5,42.5 79.5,45.5 82.5,45.5 62.5,42.5 59.5,42.5 59.5,45.5 62.5,45.5 82.5,30.5 79.5,30.5 102.5,30.5 99.5,30.5 99.5,33.5 102.5,33.5 122.5,30.5 119.5,30.5 122.5,33.5 97.5,24.5 94.5,24.5 94.5,27.5 97.5,27.5 77.5,24.5 74.5,24.5 74.5,27.5 77.5,27.5 117.5,24.5 114.5,24.5 114.5,27.5 117.5,27.5 137.5,24.5 134.5,27.5 137.5,27.5 102.5,18.5 99.5,18.5 99.5,21.5 102.5,21.5 122.5,18.5 119.5,18.5 119.5,21.5 122.5,21.5 82.5,18.5 79.5,18.5 79.5,21.5 82.5,21.5 62.5,18.5 60,18.5 60,21.5 62.5,21.5 62.5,30.5 59.5,30.5 59.5,33.5 62.5,33.5 139.5,18.5 142.5,21.5 139.5,21.5 77.5,36.5 74.5,36.5 74.5,39.5 77.5,39.5 97.5,36.5 94.5,36.5 94.5,39.5 97.5,39.5 67.5,48.5 64.5,48.5 64.5,51.5 67.5,51.5 87.5,48.5 84.5,48.5 84.5,51.5 87.5,51.5 107.5,48.5 104.5,48.5 104.5,51.5 107.5,51.5 127.5,48.5 124.5,48.5 124.5,51.5 127.5,51.5 127.5,36.5 124.5,36.5 124.5,39.5 127.5,39.5 107.5,36.5 104.5,36.5 104.5,39.5 107.5,39.5 67.5,36.5 64.5,36.5 64.5,39.5 67.5,39.5 87.5,36.5 84.5,36.5 84.5,39.5 87.5,39.5 52,1 62,1 72,1 82,1 92,1 102,1 112,1 132,1 142,1 52,69 62,69 72,69 82,69 92,69 102,69 112,69 122,69 132,69 142,69 142.5,18.5 134.5,24.5 144.5,24.5 147.5,24.5 147.5,27.5 144.5,27.5 127.5,24.5 127.5,27.5 124.5,27.5 124.5,24.5 104.5,27.5 104.5,24.5 107.5,24.5 107.5,27.5 84.5,27.5 87.5,27.5 87.5,24.5 84.5,24.5 67.5,27.5 64.5,27.5 64.5,24.5 67.5,24.5 57.5,27.5 57.5,24.5 54.5,27.5 54.5,24.5 142.5,33.5 139.5,33.5 139.5,30.5 142.5,30.5 142.5,42.5 142.5,45.5 139.5,42.5 139.5,45.5 147.5,39.5 144.5,39.5 144.5,36.5 147.5,36.5 57.5,36.5 57.5,39.5 54.5,39.5 54.5,36.5 144.5,48.5 144.5,51.5 147.5,51.5 147.5,48.5 27.9,20.3 82,55 92,55 132,55 132,57 102,57 92,57 62,57 142,57 142,55 146,31 142,14 122,14 102,14 82,14 63.6,9 151,1 151,10 151,20 151,30 151,40 151,50 151,60 122,1 132,14 112,14 92,14 72,14 50.2,11.4 53.7,12.1 56.1,11.9 122,57 112,57 82,57 72,57 122,55 112,55 102,55 72,55 62,55 132,17.3 112,17.3 92,17.3 72,17.3 50,14 54.8,22.9 130.7,30.3 133.5,30.3 133.5,29 7.9,15.3 18.95,39.4 17.95,39.4 17.95,38.5 18.95,38.5 17.85,53.6 18.75,53.6 17.85,52.8 18.75,52.8 17.8,65.8 18.8,65.8 18.8,64.8 17.8,64.8 35.83,25.93 33.45,25.93 4.6,18.6 15.6,12.2 40.9,26.2 23.9,38.7 28.6,40.5 27.7,40.5 26.7,40.5 26,41.1 26,42.2 26,43.1 26.7,43.7 27.7,43.7 28.6,43.7 29.2,41.1 29.2,42.1 29.2,42.9 29.5,54.5 25.9,54.6 26,68.7 26,67.8 47.3,58.8 48.4,57.5 47.4,56.2 47.5,35.6 48.9,34.4 47.6,32.9 13.55,54.61 12.44,65.82 13.1,64.89 13.24,66.61 12.27,39.66 13.11,40.53 23.5,65 25.9,55.4 27.6,53.8 26.8,53.8 28.4,53.8 29.5,55.3 17.9,18.3 14.4,18.7 11.8,21 29.3,66.8 29.3,67.8 29.3,68.7 44.82,44.24 43.55,43.1 42.33,44.23 5.5,25.7 10.2,56.7 12.3,56.8 42,69 32,69 21,69 12,69 2,69 1,59 1,49 1,39 1,29 1,19 1,9 1,1 11,1 77.37,5.68 31,1 41,1 11.85,64.53 10.99,63.66 14.44,60.41 10.73,51.6 11.69,52.59 14.31,48.48 10.77,37.51 11.55,38.46 11.61,36.56 15.26,35.27 18.84,34.77 22.04,35.89 18.3,49 21.6,50.4 21.6,62.7 18.4,61.3 78.5,4.2 79.6,5.7 77.38,5 79.6,5 79.6,6.3 77.36,6.3
  pour Top (rank 6): 0,70 0,0 152,0 152,70
  pour Bottom (rank 6): 0,70 0,0 152,0 152,70
  pour Route2 (isolate 0.2): 0,-0.1 152,-0.1 152,70 0,70
  pour Route15 (rank 6): -0.3,69.9 -0.3,-0.1 151.7,-0.1 151.7,69.9
GND1  (via drill 0.25)
  other vias: 99.5,42.5
N$1
  Top 0.2: U4.9 10.93,55.6 11.1,55.77 11.1,56.26 10.8,56.56 TP16.1
N$2  (via drill 0.25)
  Top 1: v58.5,20.5 58.5,22.5 60.5,24.5 60.5,27.5 58.5,29.5 v58.5,31.5
  other vias: 59.5,20.5 59.5,19.5 59.5,31.5 58.5,19.5 59.5,32.5 58.5,32.5
  pour Top (no thermals): 60.5,19 60.5,21 58,21 58,19
  pour Bottom (no thermals): 60.5,19 60.5,21 58,21 58,19
  pour Bottom (no thermals): 60.5,31 60.5,33 58,33 58,31
  pour Top (no thermals): 58,33 60.5,33 60.5,31 58,31
N$3
  Top 0.152: R28.1 11.36,55.6 10.86,55.1 U4.8
N$4
  Top 0.152: R30.1 11.01,54.7 10.91,54.6 U4.7
N$5  (via drill 0.25)
  other vias: 144.5,38.5 144.5,37.5 127.5,38.5 127.5,37.5 143.5,37.5 143.5,38.5 128.5,37.5 128.5,38.5
  pour Bottom (no thermals): 145.5,39 145.5,37 143,37 140.5,34.5 131.5,34.48 131.5,34.5 129,37 126.5,37 126.5,39 129,39 129,38.5 132,35.5 140,35.5 143,38.5 143,39
  pour Top (no thermals): 143,39 145.5,39 145.5,37 143,37
  pour Top (no thermals): 126.5,39 129,39 129,37 126.5,37
N$6
  Top 0.152: 12.74,37.55 R5.2
  Top 0.2: R6.1 14.15,37.55 14.31,37.71 14.31,37.99 15.21,38.9 U3.3 | R6.1 12.74,37.55 | TP9.1 13.6,36.8 R6.1
N$7  (via drill 0.25)
  other vias: 124.5,38.5 124.5,37.5 107.5,37.5 107.5,38.5 123.5,37.5 123.5,38.5 108.5,37.5
  pour Top (no thermals): 123,39 125.5,39 125.5,37 123,37
  pour Bottom (no thermals): 125.5,39 125.5,37 123,37 120.52,34.52 111.5,34.5 109,37 106.5,37 106.5,39 109,39 109,38.5 112,35.5 120,35.5 123,38.5 123,39
  pour Top (no thermals): 106.5,39 109,39 109,37 106.5,37
N$8  (via drill 0.25)
  other vias: 104.5,37.5 104.5,38.5 87.5,37.5 87.5,38.5 103.5,38.5 103.5,37.5 88.5,37.5 88.5,38.5
  pour Top (no thermals): 103,39 105.5,39 105.5,37 103,37
  pour Bottom (no thermals): 105.5,39 105.5,37 103,37 100.5,34.5 91.5,34.48 91.5,34.5 89,37 86.5,37 86.5,39 89,39 89,38.5 92,35.5 100,35.5 103,38.5 103,39
  pour Top (no thermals): 86.5,39 89,39 89,37 86.5,37
N$8SHSHOW  (via drill 0.25)
  other vias: 74.5,37.5 74.5,38.5 57.5,37.5 57.5,38.5 73.5,38.5 73.5,37.5 58.5,37.5 58.5,38.5
  pour Top (no thermals): 73,39 75.5,39 75.5,37 73,37
  pour Bottom (no thermals): 56.5,37 56.5,39 59,39 61.5,41.5 70.5,41.52 70.5,41.5 73,39 75.5,39 75.5,37 73,37 73,37.5 70,40.5 62,40.5 59,37.5 59,37
  pour Top (no thermals): 56.5,39 59,39 59,37 56.5,37
N$9  (via drill 0.25)
  other vias: 84.5,38.5 84.5,37.5 67.5,38.5 67.5,37.5 83.5,38.5 83.5,37.5 68.5,37.5 68.5,38.5
  pour Top (no thermals): 83,39 85.5,39 85.5,37 83,37
  pour Bottom (no thermals): 85.5,39 85.5,37 83,37 80.5,34.5 71.5,34.48 71.5,34.5 69,37 66.5,37 66.5,39 69,39 69,38.5 72,35.5 80,35.5 83,38.5 83,39
  pour Top (no thermals): 66.5,39 69,39 69,37 66.5,37
N$10  (via drill 0.25)
  other vias: 84.5,25.5 67.5,26.5 68.5,25.5 84.5,26.5 83.5,26.5 83.5,25.5 67.5,25.5 68.5,26.5
  pour Bottom (no thermals): 85.5,27 85.5,25 83,25 80.5,22.5 71.5,22.48 71.5,22.5 69,25 66.5,25 66.5,27 69,27 69,26.5 72,23.5 80,23.5 83,26.5 83,27
  pour Top (no thermals): 83,27 85.5,27 85.5,25 83,25
  pour Top (no thermals): 66.5,27 69,27 69,25 66.5,25
N$11  (via drill 0.25)
  other vias: 87.5,25.5 104.5,25.5 104.5,26.5 103.5,26.5 103.5,25.5 87.5,26.5 88.5,26.5 88.5,25.5
  pour Bottom (no thermals): 105.5,27 105.5,25 103,25 100.5,22.5 91.5,22.48 91.5,22.5 89,25 86.5,25 86.5,27 89,27 89,26.5 92,23.5 100,23.5 103,26.5 103,27
  pour Top (no thermals): 103,27 105.5,27 105.5,25 103,25
  pour Top (no thermals): 86.5,27 89,27 89,25 86.5,25
N$12  (via drill 0.25)
  other vias: 124.5,25.5 123.5,25.5 107.5,25.5 124.5,26.5 123.5,26.5 107.5,26.5 108.5,26.5 108.5,25.5
  pour Bottom (no thermals): 125.5,27 125.5,25 123,25 120.5,22.5 111.5,22.48 111.5,22.5 109,25 106.5,25 106.5,27 109,27 109,26.5 112,23.5 120,23.5 123,26.5 123,27
  pour Top (no thermals): 123,27 125.5,27 125.5,25 123,25
  pour Top (no thermals): 106.5,27 109,27 109,25 106.5,25
N$13  (via drill 0.25)
  other vias: 144.5,25.5 127.5,25.5 144.5,26.5 143.5,26.5 143.5,25.5 127.5,26.5 128.5,26.5 128.5,25.5
  pour Top (no thermals): 143,27 145.5,27 145.5,25 143,25
  pour Top (no thermals): 126.5,27 129,27 129,25 126.5,25
  pour Bottom (no thermals): 145.5,27 145.5,25 143,25 140.5,22.5 131.5,22.48 131.5,22.5 129,25 126.5,25 126.5,27 129,27 129,26.5 132,23.5 140,23.5 143,26.5 143,27
N$14  (via drill 0.25)
  other vias: 67.5,50.5 84.5,49.5 67.5,49.5 84.5,50.5 68.5,49.5 68.5,50.5 83.5,50.5 83.5,49.5
  pour Top (no thermals): 83,51 85.5,51 85.5,49 83,49
  pour Bottom (no thermals): 85.5,51 85.5,49 83,49 80.5,46.5 71.5,46.48 71.5,46.5 69,49 66.5,49 66.5,51 69,51 69,50.5 72,47.5 80,47.5 83,50.5 83,51
  pour Top (no thermals): 66.5,51 69,51 69,49 66.5,49
N$15  (via drill 0.25)
  other vias: 104.5,50.5 87.5,49.5 104.5,49.5 87.5,50.5 88.5,50.5 88.5,49.5 103.5,49.5 103.5,50.5
  pour Top (no thermals): 103,51 105.5,51 105.5,49 103,49
  pour Bottom (no thermals): 105.5,51 105.5,49 103,49 100.5,46.5 91.5,46.48 91.5,46.5 89,49 86.5,49 86.5,51 89,51 89,50.5 92,47.5 100,47.5 103,50.5 103,51
  pour Top (no thermals): 86.5,51 89,51 89,49 86.5,49
N$16  (via drill 0.25)
  other vias: 124.5,50.5 107.5,49.5 124.5,49.5 107.5,50.5 108.5,50.5 108.5,49.5 123.5,49.5 123.5,50.5
  pour Top (no thermals): 123,51 125.5,51 125.5,49 123,49
  pour Bottom (no thermals): 125.5,51 125.5,49 123,49 120.5,46.5 111.5,46.48 111.5,46.5 109,49 106.5,49 106.5,51 109,51 109,50.5 112,47.5 120,47.5 123,50.5 123,51
  pour Top (no thermals): 106.5,51 109,51 109,49 106.5,49
N$17  (via drill 0.25)
  other vias: 144.5,50.5 127.5,50.5 144.5,49.5 127.5,49.5 128.5,49.5 128.5,50.5 143.5,50.5 143.5,49.5
  pour Top (no thermals): 143,51 145.5,51 145.5,49 143,49
  pour Bottom (no thermals): 145.5,51 145.5,49 143,49 140.5,46.5 131.5,46.48 131.5,46.5 129,49 126.5,49 126.5,51 129,51 129,50.5 132,47.5 140,47.5 143,50.5 143,51
  pour Top (no thermals): 126.5,51 129,51 129,49 126.5,49
N$18  (via drill 0.25)
  Top 0.2: U2.6 21.15,52.2 21.58,51.77 21.58,51.57 v22.18,50.97 22.18,49.16 22.3,49.03 TP7.1 R25.1 | R30.2 12.94,54.7 13.53,55.3 v13.8,55.3
  Bottom 0.2: v22.18,50.97 21.07,50.97 20.9,50.8 14.9,50.8 12.92,52.78 12.92,54.79 13.44,55.3 13.8,55.3 v13.8,55.3
N$19
  Top 0.2: R23.2 15.34,37.68 15.56,37.9 U3.5
N$20  (via drill 0.25)
  other vias: 133.5,38.5 134.5,38.5 117.5,37.5 117.5,38.5 134.5,37.5 133.5,37.5 118.5,38.5 118.5,37.5
  pour Top (no thermals): 133,39 135.5,39 135.5,37 133,37
  pour Bottom (no thermals): 116.5,37 116.5,39 119,39 121.5,41.5 130.5,41.52 130.5,41.5 133,39 135.5,39 135.5,37 133,37 133,37.5 130,40.5 122,40.5 119,37.5 119,37
  pour Top (no thermals): 116.5,39 119,39 119,37 116.5,37
N$21  (via drill 0.25)
  other vias: 114.5,37.5 114.5,38.5 97.5,37.5 97.5,38.5 113.5,38.5 113.5,37.5 98.5,38.5 98.5,37.5
  pour Top (no thermals): 113,39 115.5,39 115.5,37 113,37
  pour Bottom (no thermals): 96.5,37 96.5,39 99,39 101.5,41.5 110.5,41.52 110.5,41.5 113,39 115.5,39 115.5,37 113,37 113,37.5 110,40.5 102,40.5 99,37.5 99,37
  pour Top (no thermals): 96.5,39 99,39 99,37 96.5,37
N$22
  Top 0.2: C3.2 20.45,68.4 21.07,67.78 D3.C | TP26.1 27.6,62.3
  pour Top (no thermals): 20,66.2 23,66.2 25.9,63.3 25.9,61.2 26.3,60.8 32,60.8 32,66.1 26.3,66.1 24.6,67.8 24.6,68.9 20,68.9
N$23  (via drill 0.25)
  other vias: 94.5,37.5 94.5,38.5 77.5,37.5 77.5,38.5 93.5,38.5 93.5,37.5 78.5,37.5 78.5,38.5
  pour Top (no thermals): 93,39 95.5,39 95.5,37 93,37
  pour Bottom (no thermals): 76.5,37 76.5,39 79,39 81.5,41.5 90.5,41.52 90.5,41.5 93,39 95.5,39 95.5,37 93,37 93,37.5 90,40.5 82,40.5 79,37.5 79,37
  pour Top (no thermals): 76.5,39 79,39 79,37 76.5,37
N$24
  Top 0.2: C2.2 19.25,56 19.72,55.53 D2.C | TP25.1 26.8,50.2 27.6,51
  pour Top (no thermals): 19.9,54.2 19.9,56 21.4,56 22.1,56.7 24.4,56.7 24.4,55.5 27,52.9 31.9,52.9 31.9,47.7 29.1,47.7 22.6,54.2
N$25
  Top 0.2: C1.2 21.6,41.9 | TP24.1 20.9,43.1
  pour Top (no thermals): 20.1,39.8 23.5,39.8 29.1,34.2 31.9,34.2 31.9,39.5 26.6,39.5 24.4,41.7 24.4,43.2 20.1,43.2
N$26  (via drill 0.25)
  other vias: 57.5,26.5 73.5,26.5 74.5,26.5 74.5,25.5 73.5,25.5 57.5,25.5 58.5,25.5 58.5,26.5
  pour Bottom (no thermals): 56.5,25 56.5,27 59,27 61.5,29.5 70.5,29.52 70.5,29.5 73,27 75.5,27 75.5,25 73,25 73,25.5 70,28.5 62,28.5 59,25.5 59,25
  pour Top (no thermals): 73,27 75.5,27 75.5,25 73,25
  pour Top (no thermals): 56.5,27 59,27 59,25 56.5,25
N$27  (via drill 0.25)
  other vias: 77.5,26.5 93.5,26.5 94.5,25.5 94.5,26.5 93.5,25.5 78.5,26.5 77.5,25.5 78.5,25.5
  pour Bottom (no thermals): 76.5,25 76.5,27 79,27 81.5,29.5 90.5,29.52 90.5,29.5 93,27 95.5,27 95.5,25 93,25 93,25.5 90,28.5 82,28.5 79,25.5 79,25
  pour Top (no thermals): 93,27 95.5,27 95.5,25 93,25
  pour Top (no thermals): 76.5,27 79,27 79,25 76.5,25
N$28
  Top 0.2: R4.1 7.15,54.4 6.97,54.23 | 6.97,54.23 6.85,54.1 U4.5 5.26,54.1 5.03,53.87 5.03,33.72 9.33,29.42 PCB1.14 | 6.97,54.23 8,53.2 TP14.1
N$29  (via drill 0.25)
  other vias: 97.5,26.5 114.5,26.5 114.5,25.5 113.5,25.5 113.5,26.5 97.5,25.5 98.5,25.5 98.5,26.5
  pour Bottom (no thermals): 96.5,25 96.5,27 99,27 101.5,29.5 110.5,29.52 110.5,29.5 113,27 115.5,27 115.5,25 113,25 113,25.5 110,28.5 102,28.5 99,25.5 99,25
  pour Top (no thermals): 113,27 115.5,27 115.5,25 113,25
  pour Top (no thermals): 96.5,27 99,27 99,25 96.5,25
N$30  (via drill 0.25)
  other vias: 117.5,26.5 134.5,26.5 133.5,26.5 134.5,25.5 133.5,25.5 117.5,25.5 118.5,26.5 118.5,25.5
  pour Top (no thermals): 133,27 135.5,27 135.5,25 133,25
  pour Top (no thermals): 116.5,27 119,27 119,25 116.5,25
  pour Bottom (no thermals): 116.5,25 116.5,27 119,27 121.5,29.5 130.5,29.52 130.5,29.5 133,27 135.5,27 135.5,25 133,25 133,25.5 130,28.5 122,28.5 119,25.5 119,25
N$31  (via drill 0.25)
  other vias: 57.5,50.5 74.5,49.5 74.5,50.5 57.5,49.5 58.5,49.5 58.5,50.5 73.5,49.5 73.5,50.5
  pour Top (no thermals): 73,51 75.5,51 75.5,49 73,49
  pour Bottom (no thermals): 56.3,49 56.3,51 59,51 61.5,53.5 70.5,53.52 70.5,53.5 73,51 75.5,51 75.5,49 73,49 73,49.5 70,52.5 62,52.5 59,49.5 59,49
  pour Top (no thermals): 56.3,51 59,51 59,49 56.3,49
N$32
  Top 0.152: U4.6 10.81,54.1 11.11,53.8 R31.1
N$33
  Top 0.2: C12.1 U3.8
N$34
  Top 0.2: U1.1 C3.1
N$35  (via drill 0.25)
  other vias: 62.5,44.5 79.5,44.5 79.5,43.5 62.5,43.5 78.5,43.5 78.5,44.5 63.5,44.5 63.5,43.5
  pour Top (no thermals): 78,45 80.5,45 80.5,43 78,43
  pour Bottom (no thermals): 80.5,45 80.5,43 61.5,43 61.5,45
  pour Top (no thermals): 61.5,45 64,45 64,43 61.5,43
N$36  (via drill 0.25)
  other vias: 82.5,43.5 99.5,44.5 99.5,43.5 82.5,44.5 98.5,43.5 98.5,44.5 83.5,44.5 83.5,43.5
  pour Top (no thermals): 98,45 100.5,45 100.5,43 98,43
  pour Bottom (no thermals): 100.5,45 100.5,43 81.5,43 81.5,45
  pour Top (no thermals): 81.5,45 84,45 84,43 81.5,43
N$37  (via drill 0.25)
  other vias: 102.5,44.5 119.5,44.5 119.5,43.5 102.5,43.5 118.5,43.5 118.5,44.5 103.5,44.5 103.5,43.5
  pour Top (no thermals): 118,45 120.5,45 120.5,43 118,43
  pour Bottom (no thermals): 120.5,45 120.5,43 101.5,43 101.5,45
  pour Top (no thermals): 101.5,45 104,45 104,43 101.5,43
N$38  (via drill 0.25)
  other vias: 122.5,43.5 139.5,44.5 122.5,44.5 139.5,43.5 138.5,43.5 138.5,44.5 123.5,44.5 123.5,43.5
  pour Top (no thermals): 138,45 140.5,45 140.5,43 138,43
  pour Bottom (no thermals): 140.5,45 140.5,43 121.5,43 121.5,45
  pour Top (no thermals): 121.5,45 124,45 124,43 121.5,43
N$39  (via drill 0.25)
  other vias: 122.5,32.5 139.5,32.5 139.5,31.5 122.5,31.5 138.5,31.5 138.5,32.5 123.5,31.5 123.5,32.5
  pour Top (no thermals): 138,33 140.5,33 140.5,31 138,31
  pour Bottom (no thermals): 140.5,33 140.5,31 121.5,31 121.5,33
  pour Top (no thermals): 121.5,33 124,33 124,31 121.5,31
N$40  (via drill 0.25)
  other vias: 102.5,32.5 119.5,32.5 118.5,31.5 102.5,31.5 119.5,31.5 118.5,32.5 103.5,32.5 103.5,31.5
  pour Top (no thermals): 118,33 120.5,33 120.5,31 118,31
  pour Bottom (no thermals): 120.5,33 120.5,31 101.5,31 101.5,33
  pour Top (no thermals): 101.5,33 104,33 104,31 101.5,31
N$41  (via drill 0.25)
  other vias: 82.5,32.5 99.5,32.5 98.5,31.5 83.5,31.5 99.5,31.5 98.5,32.5 82.5,31.5 83.5,32.5
  pour Top (no thermals): 98,33 100.5,33 100.5,31 98,31
  pour Bottom (no thermals): 100.5,33 100.5,31 81.5,31 81.5,33
  pour Top (no thermals): 81.5,33 84,33 84,31 81.5,31
N$42  (via drill 0.25)
  other vias: 62.5,32.5 79.5,31.5 79.5,32.5 62.5,31.5 78.5,32.5 78.5,31.5
  pour Top (no thermals): 78,33 80.5,33 80.5,31 78,31
  pour Bottom (no thermals): 80.5,33 80.5,31 61.5,31 61.5,33
  pour Top (no thermals): 61.5,33 64,33 64,31 61.5,31
N$43  (via drill 0.25)
  other vias: 62.5,20.5 79.5,20.5 62.5,19.5 79.5,19.5 78.5,19.5 78.5,20.5 63.5,19.5 63.5,20.5
  pour Top (no thermals): 80.5,19 80.5,21 78,21 78,19
  pour Top (no thermals): 64,19 64,21 61.5,21 61.5,19
  pour Bottom (no thermals): 80.5,19 80.5,21 61.5,21 61.5,19
N$44  (via drill 0.25)
  other vias: 82.5,20.5 99.5,20.5 98.5,20.5 98.5,19.5 99.5,19.5 83.5,20.5 83.5,19.5 82.5,19.5
  pour Top (no thermals): 100.5,19 100.5,21 98,21 98,19
  pour Bottom (no thermals): 100.5,19 100.5,21 81.5,21 81.5,19
  pour Top (no thermals): 81.5,21 81.5,19 84,19 84,21
N$45  (via drill 0.25)
  other vias: 102.5,20.5 119.5,20.5 118.5,20.5 118.5,19.5 119.5,19.5 102.5,19.5 103.5,19.5 103.5,20.5
  pour Top (no thermals): 120.5,19 120.5,21 118,21 118,19
  pour Bottom (no thermals): 120.5,19 120.5,21 101.5,21 101.5,19
  pour Top (no thermals): 101.5,21 104,21 104,19 101.5,19
N$46  (via drill 0.25)
  other vias: 122.5,19.5 139.5,20.5 139.5,19.5 138.5,19.5 138.5,20.5 122.5,20.5 123.5,19.5 123.5,20.5
  pour Top (no thermals): 140.5,19 140.5,21 138,21 138,19
  pour Bottom (no thermals): 140.5,21 140.5,19 121.5,19 121.5,21
  pour Top (no thermals): 121.5,21 121.5,19 124,19 124,21
N$47
  Top 0.2: U3.1 16.36,40.7 16.15,40.91 C1.1
N$48  (via drill 0.25)
  other vias: 77.5,49.5 94.5,50.5 77.5,50.5 78.5,50.5 78.5,49.5 94.5,49.5 93.5,49.5 93.5,50.5
  pour Top (no thermals): 93,51 95.5,51 95.5,49 93,49
  pour Bottom (no thermals): 76.5,49 76.5,51 79,51 81.5,53.5 90.5,53.52 90.5,53.5 93,51 95.5,51 95.5,49 93,49 93,49.5 90,52.5 82,52.5 79,49.5 79,49
  pour Top (no thermals): 76.5,51 79,51 79,49 76.5,49
N$49  (via drill 0.25)
  other vias: 97.5,50.5 114.5,49.5 97.5,49.5 98.5,49.5 98.5,50.5 114.5,50.5 113.5,50.5 113.5,49.5
  pour Top (no thermals): 113,51 115.5,51 115.5,49 113,49
  pour Bottom (no thermals): 96.5,49 96.5,51 99,51 101.5,53.5 110.5,53.52 110.5,53.5 113,51 115.5,51 115.5,49 113,49 113,49.5 110,52.5 102,52.5 99,49.5 99,49
  pour Top (no thermals): 96.5,51 99,51 99,49 96.5,49
N$50  (via drill 0.25)
  other vias: 117.5,50.5 134.5,50.5 117.5,49.5 118.5,49.5 118.5,50.5 134.5,49.5 133.5,49.5 133.5,50.5
  pour Bottom (no thermals): 116.5,49 116.5,51 119,51 121.5,53.5 130.5,53.52 130.5,53.5 133,51 135.5,51 135.5,49 133,49 133,49.5 130,52.5 122,52.5 119,49.5 119,49
  pour Top (no thermals): 133,51 135.5,51 135.5,49 133,49
  pour Top (no thermals): 116.5,51 119,51 119,49 116.5,49
N$51
  Top 0.2: C2.1 U2.1
N$52
  Top 0.2: TP10.1 12.79,50.78 R7.2 13.74,51.64 R8.1 14.4,51.76 14.47,51.83 14.47,52.16 15.51,53.2 U2.3
N$53
  Top 0.2: U1.3 15.41,65.31 14.6,64.5 14.6,63.8 14.46,63.66 R10.1 R9.2 12.95,62.91 TP11.1
N$54
  Top 0.2: R16.2 21.85,52.1 21.25,52.7 U2.7
N$55
  Top 0.2: U3.7 21.31,38.4 21.81,37.9 R17.2
N$56  (via drill 0.25)
  Top 1: v138.5,38.5 138.5,40 136.5,42 136.5,45.5 138.5,47.5 v138.5,49.5
  other vias: 137.5,50.5 137.5,37.5 137.5,38.5 138.5,37.5 137.5,49.5 138.5,50.5
  pour Bottom (no thermals): 136.5,39 139.5,39 139.5,37 136.5,37
  pour Top (no thermals): 136.5,39 139,39 139,37 136.5,37
  pour Top (no thermals): 136.5,51 139,51 139,49 136.5,49
  pour Bottom (no thermals): 136.5,51 139.5,51 139.5,49 136.5,49
N$57  (via drill 0.25)
  Bottom 1: v53.5,37.5 v53.5,26.5
  other vias: 54.5,26.5 54.5,25.5 53.5,25.5 54.5,38.5 54.5,37.5 53.5,38.5
  pour Top (no thermals): 53,27 55.5,27 55.5,25 53,25
  pour Top (no thermals): 53,39 55.5,39 55.5,37 53,37
  pour Bottom (no thermals): 55.5,37 55.5,39 52.5,39 52.5,37
  pour Bottom (no thermals): 55.5,25 55.5,27 53,27 53,25
N$58
  Top 0.2: U1.7 21.11,64.81 21.72,64.2 R15.2
N$59  (via drill 0.25)
  Top 0.2: 43.7,46.2 R19.2 43.55,45.25 43.4,45.1 26.4,45.1 24.9,46.6 TP21.1 24.9,51.2 24,52.1 R16.1
  other vias: 148.5,25.5 147.5,26.5 147.5,25.5 148.5,26.5 57.6,60.1 58.6,60.1 59.6,60.1 60.6,60.1 61.6,60.1 57.6,61.2 58.6,61.2 59.6,61.2 60.6,61.2 61.6,61.2 57.6,59 58.6,59 59.6,59 60.6,59 61.6,59 45.3,47.2 46.3,47.2 47.3,47.2 48.3,47.2 49.3,47.2 45.3,48.3 46.3,48.3 47.3,48.3 48.3,48.3 49.3,48.3 45.3,46.1 46.3,46.1 47.3,46.1 48.3,46.1 49.3,46.1
  pour Bottom (no thermals): 146.5,27 149,27 149,25 146.5,25
  pour Top (no thermals): 146.5,27 149,27 149,25 146.5,25
  pour Route15 (isolate 0.2): 144.4,25 144.4,56.2 24.3,56.2 24.3,64.5 151.5,64.5 151.5,25
  pour Bottom: 49,63.7 49,48.8 45,48.8 45,45.6 54,45.6 54,56.1 53.9,56.2 62.4,56.2 62.5,56.1 62.5,63.7
  pour Top (no thermals): 42.6,48.6 49.6,48.6 49.6,45.6 42.6,45.6
N$61  (via drill 0.25)
  Top 0.2: R17.1 24.25,36.35 24.9,35.7 TP23.1 30.7,31 46.5,31 46.69,31.19 46.69,34.11 46.45,34.35 R20.2
  other vias: 142.5,20.5 143.5,20.5 142.5,19.5 143.5,19.5 43.2,33.2 43.2,32.3 44.1,32.3 44.1,33.2 45.1,33.2 45.1,32.3 46,32.3 46,33.2
  pour Bottom (no thermals): 141.5,21 144,21 144,19 141.5,19
  pour Top (no thermals): 141.7,21.1 144,21.1 144,19 141.7,19
  pour Route15 (isolate 0.2): 133.3,19 145.5,19 145.5,24.6 136.4,24.6 136.4,44.7 24.3,44.7 24.3,31.1 52.2,31.1 58.1,37 133.3,37
  pour Top (no thermals): 43,35 46.3,35 46.3,32 43,32
N$63
  Top 0.2: R21.2 14.9,50.45 15.2,50.75 15.2,51.87 15.53,52.2 U2.5
N$64  (via drill 0.25)
  Top 0.152: 20.4,64.31 U1.6
  Top 0.2: R26.1 TP8.1 22.88,60.3 22.88,62.47 v22.48,62.87 22.44,62.87 21.67,63.63 21.67,63.79 21.15,64.31 20.4,64.31 | R28.2 13.3,55.6 13.5,55.8 v13.5,56.2
  Bottom 0.2: v13.5,56.2 14.3,56.2 18.67,60.57 20.18,60.57 v22.48,62.87
N$65
  Top 0.2: R22.2 15,62.41 15.26,62.67 15.26,64.1 15.47,64.31 U1.5
N$66
  Top 0.2: C10.1 U2.8
N$67
  Top 0.2: C11.1 U1.8
N$68  (via drill 0.25)
  Top 0.152: v12.53,52.43 12.5,52.46
  Top 0.2: U3.6 21.25,37.9 22.5,36.65 v22.5,36.45 TP6.1 R24.1 | R31.2 12.5,52.46
  Bottom 0.2: v12.53,52.43 22.5,42.46 v22.5,36.45
N$69
  Top 0.2: C9.1 44.38,36.8 44.8,36.8
  Top 2.25: L1.P$2 44.8,36.8 51.98,43.98 59,43.98
  pour Top (no thermals): 58,45 60.5,45 60.5,43 58,43
N$70
  Top 0.2: C8.1 43.48,49.88 43.9,50.3
  Top 2.25: 64.4,50.02 61.11,50.02 58.72,47.62 53.02,47.62 50.34,50.3 43.9,50.3 L2.P$2
  pour Top (no thermals): 63,51 65.5,51 65.5,49 63,49
N$71  (via drill 0.25)
  Top 0.2: R15.1 24.2,64.2 24.8,63.6 TP22.1 26.3,57.5 28.4,57.5 29.5,58.6 46.2,58.6 46.4,58.4 46.4,57.6 46.25,57.45 R18.2
  other vias: 138.5,26.5 137.5,26.5 137.5,25.5 138.5,25.5 43,54.4 44,54.4 45,54.4 43,55.5 44,55.5 45,55.5 47.3,55 43,53.3 44,53.3 45,53.3
  pour Route15 (isolate 0.2): 136.8,25 136.8,45.1 24.3,45.1 24.3,55.8 144,55.8 144,25
  pour Top (no thermals): 136.5,27 139,27 139,25 136.5,25
  pour Bottom (no thermals): 136.5,27 139,27 139,25 136.5,25
  pour Top (no thermals): 42.7,61.6 42.7,53 46,53 46,61.6
N$72
  Top 0.2: C7.1 43.48,63.18 43.8,63.5
  Top 2.25: L3.P$2 43.8,63.5 46.1,63.5 51.45,58.15 54,55.6
  pour Top (no thermals): 55.8,56.1 55.8,49 52.9,49 49.9,51.9 49.9,56.1
N$73  (via drill 0.25)
  other vias: 72.5,12.6 73.1,12.6 73.7,12.6 73.7,12 73.1,12 72.5,12 72.5,11.4 73.1,11.4 73.7,11.4 78.5,12.6 79.1,12.6 79.7,12.6 79.7,12 79.1,12 78.5,12 78.5,11.4 79.1,11.4 79.7,11.4
  pour Route15: 133,31.4 70.8,31.4 68.8,29.4 68.8,10.5 133,10.5
  pour Top (no thermals): 80,13 72.2,13 72.2,10.2 75.4,7 75.4,4.5 76.9,4.5 76.9,7 80,10.1
N$77  (via drill 0.25)
  Top 1: v143.5,32.5 143.5,34.5 141.5,36.5 141.5,39.5 143.5,41.5 v143.5,43.5
  other vias: 142.5,44.5 142.5,43.5 142.5,31.5 142.5,32.5 143.5,31.5 143.5,44.5
  pour Bottom (no thermals): 141.5,33 144.1,33 144.1,31 141.5,31
  pour Top (no thermals): 141.5,33 144,33 144,31 141.5,31
  pour Top (no thermals): 141.5,45 144,45 144,43 141.5,43
  pour Bottom (no thermals): 141.5,45 144,45 144,43 141.5,43
N$79
  Top 0.127: 73.81,5.75 Q1.1
  Top 0.2: 16.32,6.92 19.95,3.3 47.1,3.3 49.55,5.75 R29.2 73.81,5.75 | 16.32,6.92 14.05,9.2 8,9.2 6.79,10.41 PCB1.16 | TP15.1 16.32,6.92
N$84
  Top 0.2: TP30.1 14.63,36.02 14.63,37.86 15.18,38.4 U3.4
N$85
  Top 0.2: TP28.1 13.37,49.57 13.37,50.56 13.94,51.13 14.38,51.13 14.8,51.55 14.8,52 15.5,52.7 U2.4
N$86
  Top 0.2: TP29.1 12.25,60.53 13.6,61.88 13.6,62.61 14.07,63.08 14.44,63.08 14.93,63.57 14.93,64.33 15.41,64.81 U1.4
N$88  (via drill 0.25)
  Top 1: v63.5,37.5 63.5,36 65.5,34 65.5,30 63.5,28 v63.5,26.5
  other vias: 64.5,38.5 64.5,37.5 64.5,26.5 64.5,25.5 63.5,25.5 63.5,38.5
  pour Top (no thermals): 63,27 65.5,27 65.5,25 63,25
  pour Top (no thermals): 63,39 65.5,39 65.5,37 63,37
  pour Bottom (no thermals): 65.5,25 65.5,27 62,27 62,25
  pour Bottom (no thermals): 65.5,37 65.5,39 63,39 63,37
SCL  (via drill 0.25)
  Top 0.2: PCB1.24 27.1,13.8 20.4,20.5 10.8,20.5 | 10.8,20.5 9.1,20.5 4.2,25.4 4.2,55 4.4,55.2 | R1.1 v10.85,19.6 | v10.85,21 10.85,20.55 10.8,20.5 | 4.4,55.2 4.8,55.6 U4.2 | TP19.1 4.4,55.2
  Bottom 0.2: v10.85,19.6 v10.85,21
SDA  (via drill 0.25)
  Top 0.2: PCB1.23 24.57,15.73 20.2,20.1 11.9,20.1 | 11.9,20.1 9,20.1 3.74,25.36 v3.74,53.9 | R2.1 11.88,20.08 11.9,20.1 | v4.72,54.88 4.94,55.1 U4.3
  Bottom 0.2: TP20.1 49.11,8.5 41.9,15.7 22.99,15.7 22.6,15.31 22.6,14.03 24.45,12.18 PCB1.23 | v3.74,53.9 | v3.74,53.9 v4.72,54.88

### Text on the board
tPlace: Solar Simulator v2.0 | 2020/XX/XX
dxf: OVERHANG | ALUMINUM | LEDS | ARDUINO NANO | SOLAR SIMULATOR V1.0
tDocu: B | R | B | R | B | R | B | R | B | R | G | G | G | G | G | B | R | B | R | B | R | B | R | B | R | G | G | G | G | G | B | R | B | R | B | R | B | R | B | R | G | G | G | G | G